# EAGLE board KON-SU260 (EAGLE 6.5.0), part 1 of 2
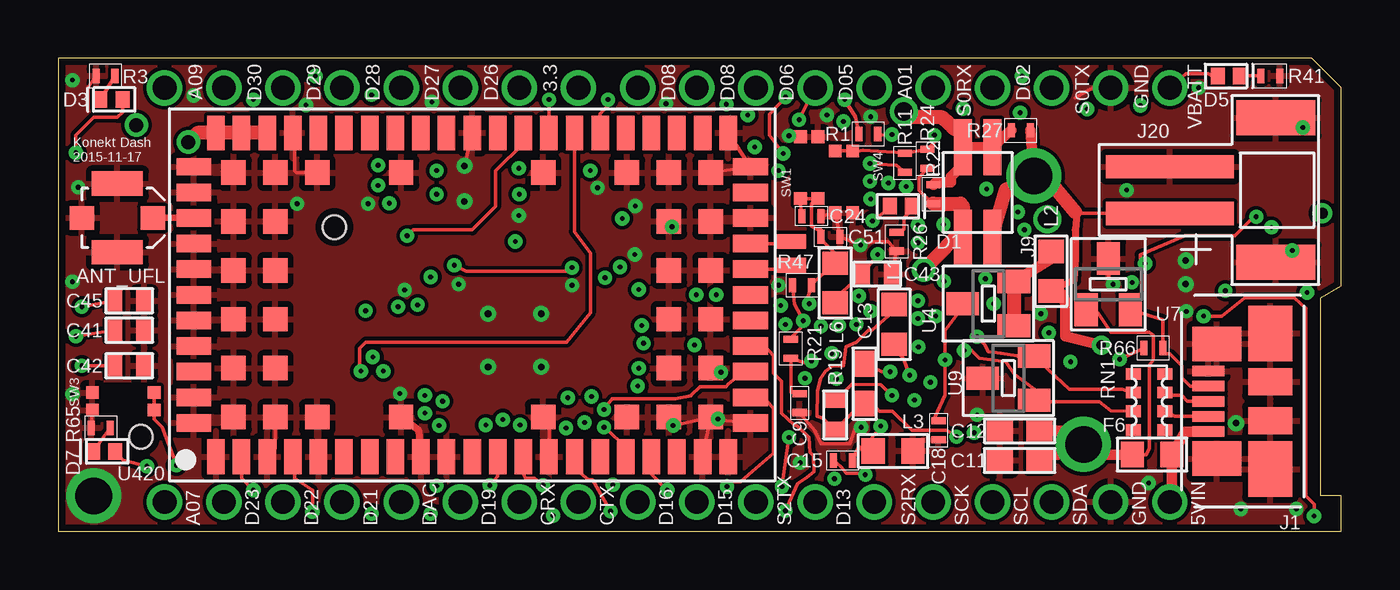
[diagram p5: board, top side]
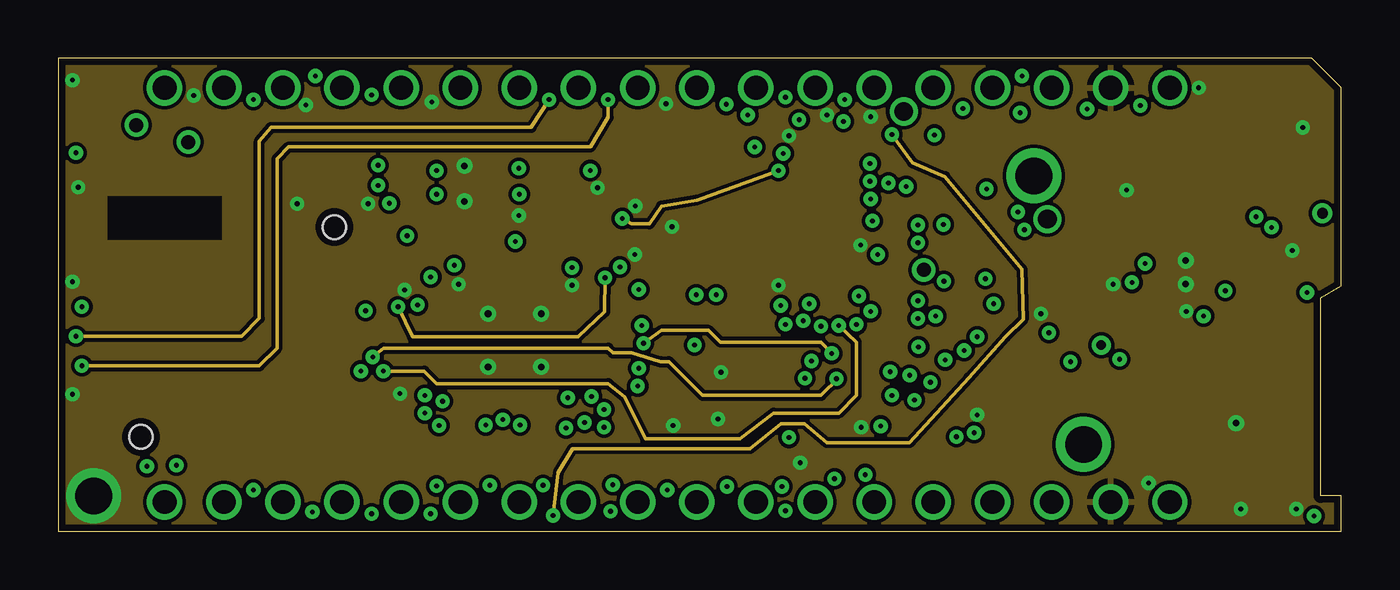
[diagram p6: board, inner layer GND2]
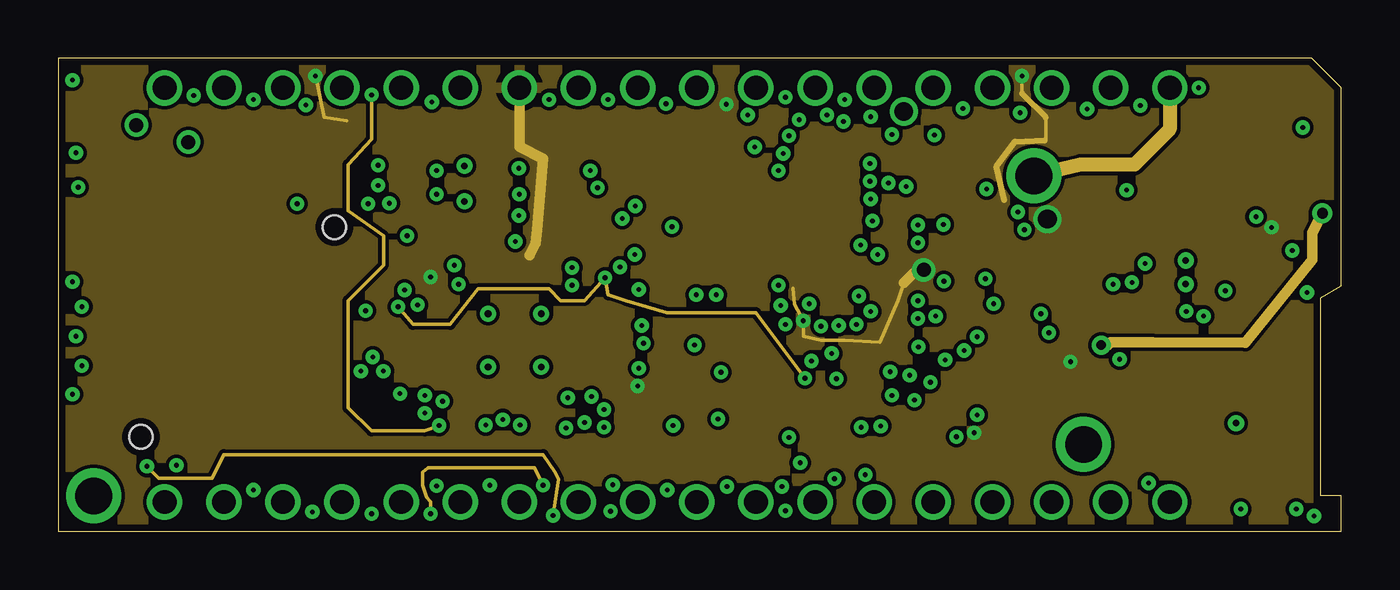
[diagram p7: board, inner layer PWR]
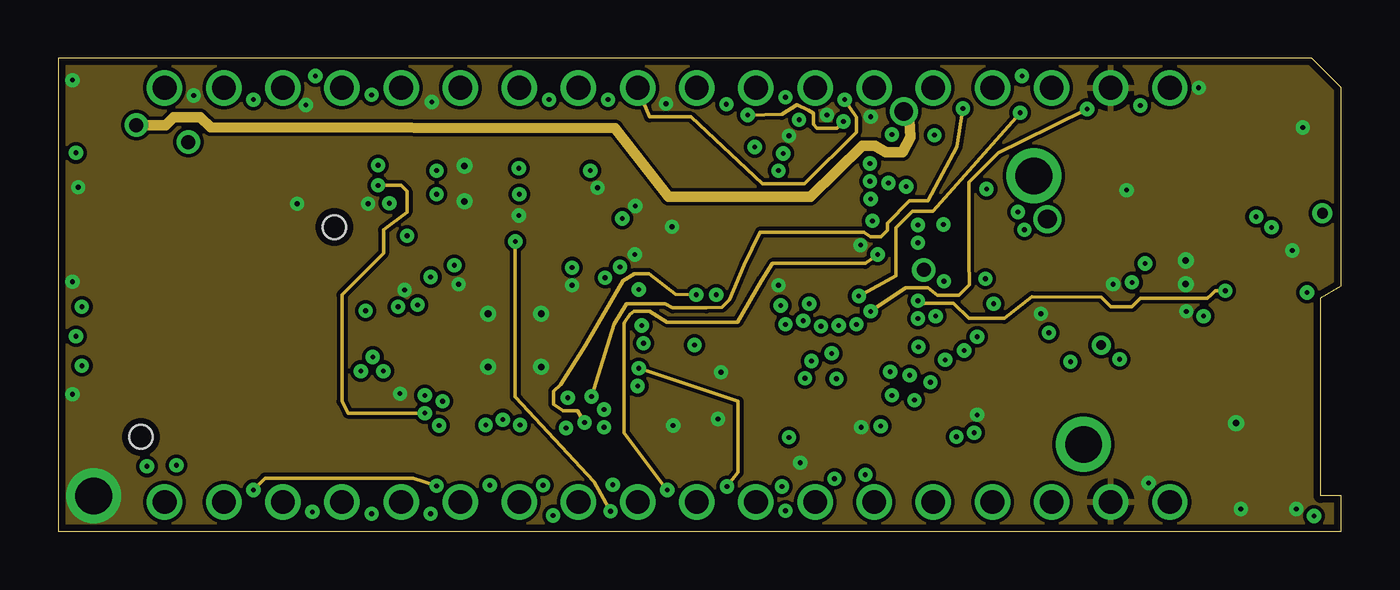
[diagram p8: board, inner layer 14]
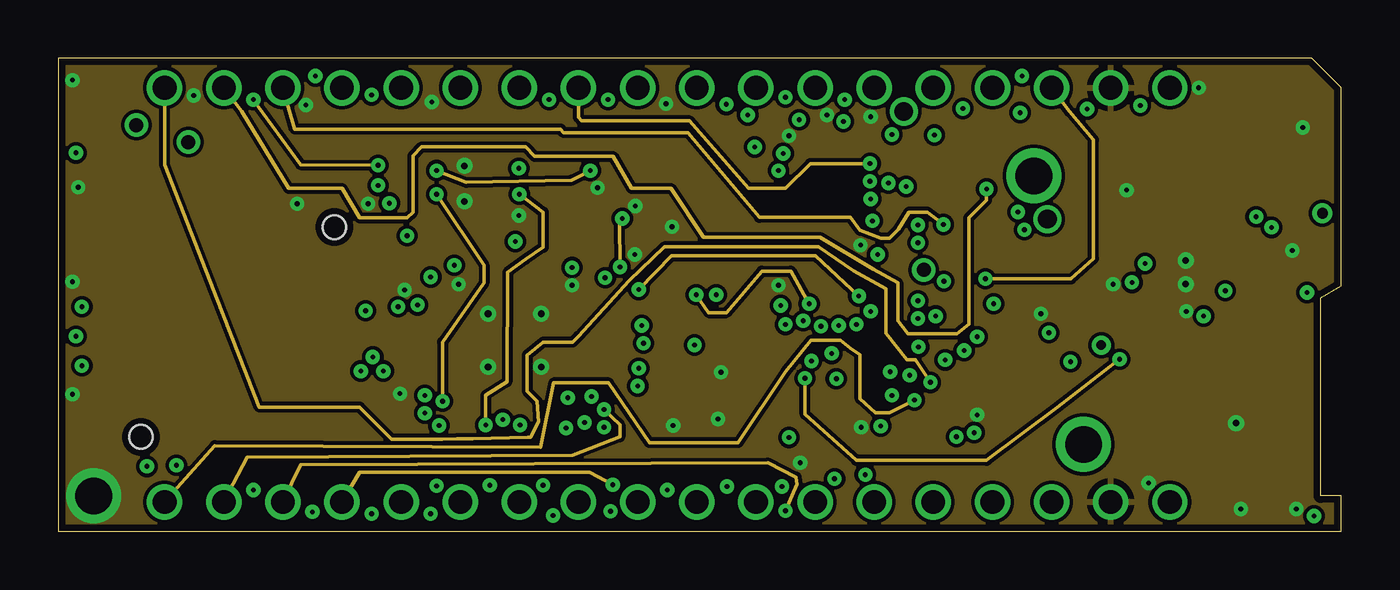
[diagram p9: board, inner layer GND13]
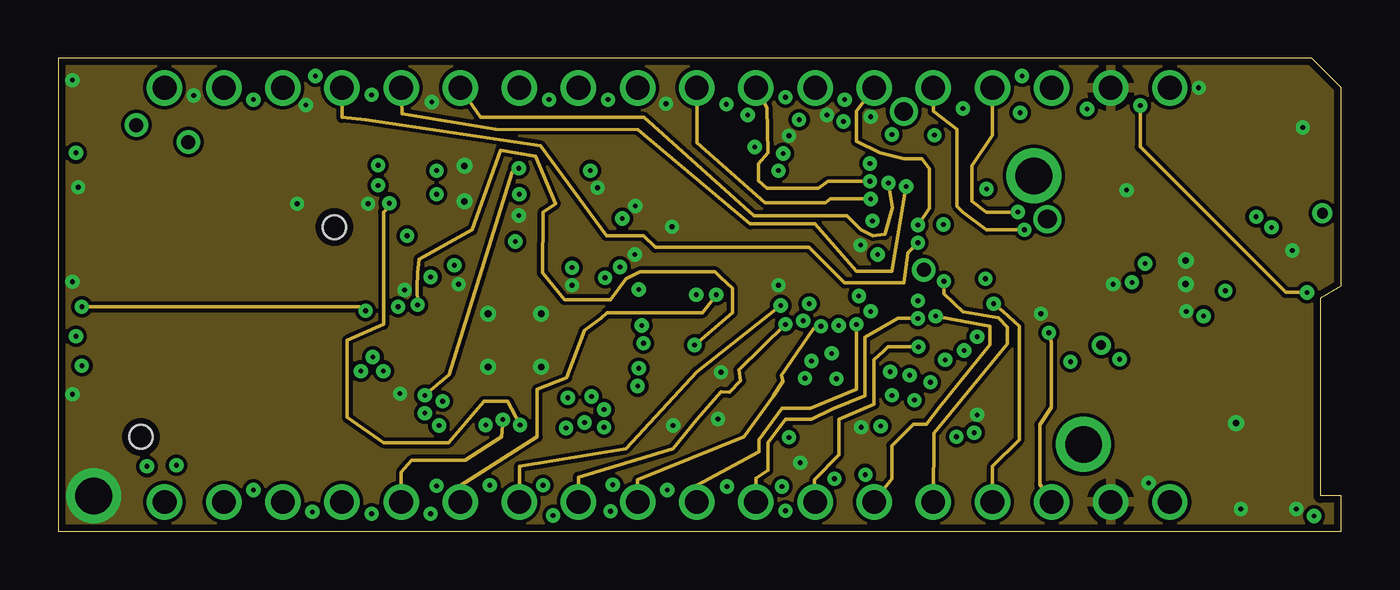
[diagram p10: board, inner layer Route14]
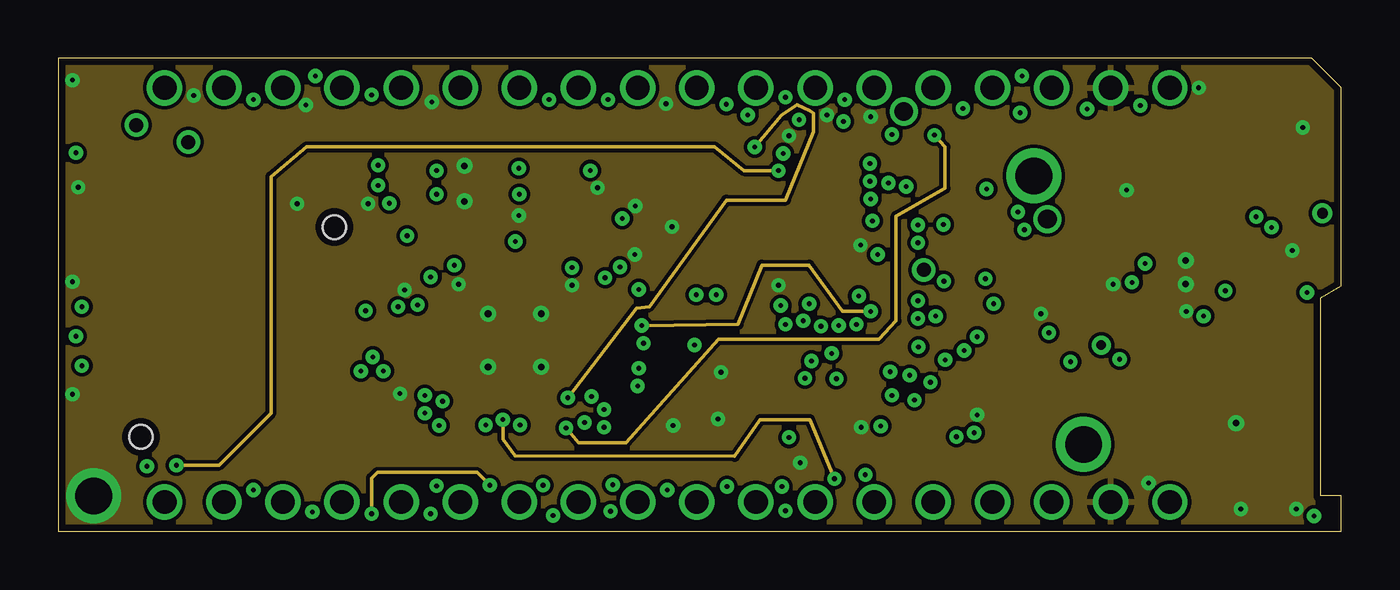
[diagram p11: board, inner layer GND15]
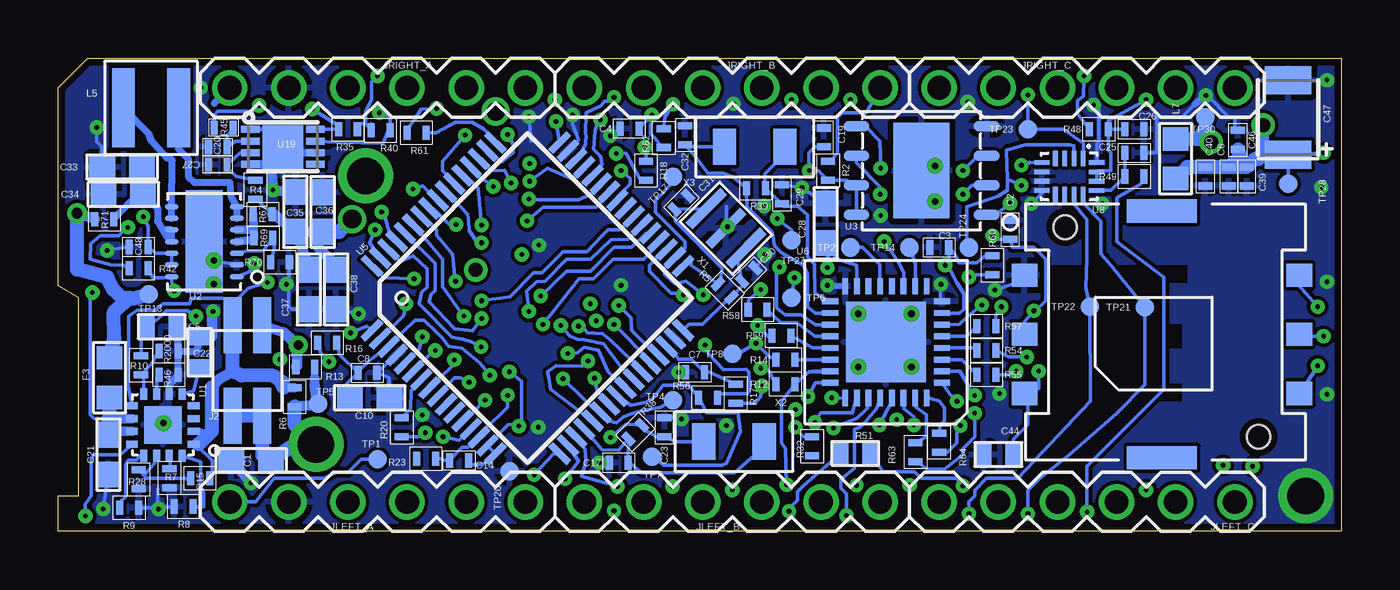
[diagram p12: board, bottom side, seen from below]

Size 55.12 x 20.32 mm. Coordinates in mm from the lower left corner, seen from the top.
Outline: 0,0 55.12,0 55.12,1.52 54.23,1.52 54.23,10.03 55.12,10.54 55.12,19.05 53.85,20.32 0,20.32 0,0
Copper layers (1*2*3*4*13*14*15*16): Top 0.01778125mm / dielectric 6.5mil / GND2 0.01778125mm / dielectric 0.5024125mm / PWR 0.01778125mm / dielectric 6.5mil / 14 0.01778125mm / dielectric 6.5mil / GND13 0.01778125mm / dielectric 6.5mil / Route14 0.01778125mm / dielectric 0.5024125mm / GND15 0.01778125mm / dielectric 6.5mil / Bottom 0.01778125mm
Design rules "default *": minimum track width 6mil, minimum drill 8mil, track to track 6mil, track to pad 6mil, pad to pad 6mil, via to via 6mil, smd to smd 6mil, copper to edge 12mil, drill to drill 8mil, minimum pad ring 10mil, minimum via ring 8mil, stop-mask expansion 4mil, vias tented up to drill 0mil, thermal gap 10mil
Net classes: 1 power: width 0.406 mm, drill 0.61 mm, clearance 0.152 mm; 2 gnd: width 0.203 mm, drill 0.203 mm, clearance 0.152 mm; 3 usbvcc: width 0.203 mm, drill 0.61 mm, clearance 0.152 mm; 4 aref: width 0.203 mm, drill 0.61 mm, clearance 0.152 mm; 5 Vbatt: width 2.5 mm, drill 1 mm, clearance 0.125 mm; 6 HIGH_SPEED: width 0.155 mm, drill 0.203 mm, clearance 0.152 mm; 7 DIFF_HIGH_SPEED: width 0.157 mm, drill 0.203 mm, clearance 0.152 mm
tRestrict: area 10.6,16.5 to 10.9,17.7
bRestrict: area 6.6,10.7 to 13,11.4; area 6.9,7.9 to 13,8.9; area 6.9,5.6 to 12.7,6.3

## Footprints (pad centres in the part's own frame; a part is rotated, then mirrored left to right if it is on the bottom)
UFL = smd 2.2 x 1.05: GND1 0,1.475; GND2 0,-1.475 | smd 1.05 x 1: GND3 -1.525,0; SIGNAL 1.525,0
C0603 = smd 1.1 x 1: 1 -0.85,0; 2 0.85,0
C0402 = smd 0.305 x 0.61: 1 -0.406,0; 2 0.406,0
C0402' = smd 0.7 x 0.9: 1 -0.65,0; 2 0.65,0
0402-CAP@1 = smd 0.305 x 0.61: 1 -0.406,0; 2 0.406,0
0402-CAP = smd 0.305 x 0.61: 1 -0.406,0; 2 0.406,0
CAPC1005X60N = smd 0.305 x 0.61: 1 -0.406,0; 2 0.406,0
1210-CAP = smd 1.2 x 2: 1 -1.6,0; 2 1.6,0
LED_0402_VISHAY_VLMW = smd 0.6 x 0.7: ANODE -0.475,0; CATHODE 0.475,0
R0603 = smd 1 x 1.1: 1 -0.85,0; 2 0.85,0
USB_MICRO_MOLEX_473460001 = smd 1.38 x 0.45: D+ 2.66,0; D- 2.66,0.65; GND 2.66,-1.3; ID 2.66,-0.65; VCC 2.66,1.3 | smd 1.9 x 2.375: GND$1 0,2.913; GND$4 0,-2.913 | smd 1.9 x 1.175: GND$2 0,0.838; GND$3 0,-0.838 | smd 2.1 x 1.475: GND$5 2.3,2.462; GND$6 2.3,-2.462
FCI_CON_1.27_2X2 = smd 0.76 x 2.4: 1 -0.635,-1.95; 2 -0.635,1.95; 3 0.635,-1.95; 4 0.635,1.95
JST-PH-2 = smd 1 x 5.5: BAT 1,-1.75; GND -1,-1.75 | smd 1.5 x 3.4: CHASSIS1 -3.1,2.8; CHASSIS2 3.1,2.8
1X06 = drill 1.016: 1 -6.35,0; 2 -3.81,0; 3 -1.27,0; 4 1.27,0; 5 3.81,0; 6 6.35,0
R0603$1 = smd 1 x 1.1: 1 -0.85,0; 2 0.85,0
COILCRAFT_XFL4020 = smd 0.98 x 3.4: P$1 -1.185,0; P$2 1.185,0
0402-RES = smd 0.305 x 0.61: 1 -0.406,0; 2 0.406,0
R0402 = smd 0.7 x 0.9: 1 -0.65,0; 2 0.65,0
CAY16 = smd 0.5 x 0.65: 1 -1.2,-0.675; 2 -0.4,-0.675; 3 0.4,-0.675; 4 1.2,-0.675; 5 1.2,0.675; 6 0.4,0.675; 7 -0.4,0.675; 8 -1.2,0.675
SIM_CARD_NANO = smd 1 x 1.1: C1 6.94,-1.75; C2 4.4,-1.75; C3 1.86,-1.75; C5 6.94,10.05; C6 4.4,10.05; C7 1.86,10.05 | smd 1 x 3: MTG1 9.7,4.15; MTG2 -0.9,4.15 | hole 1: 0,0; 9,8.3
SWITCH_PANASONIC_EVPBB = smd 0.55 x 0.55: A -1.325,0.375; A2 -1.325,-0.375; B 1.325,0.375; B2 1.325,-0.375
TP08R = smd 0.8 x 0.8: TP 0,0
BAT_CHARGE_ST_MICRO_L6924U = smd 0.3 x 0.5: 1 -0.825,-1.325; 2 -0.275,-1.325; 3 0.275,-1.325; 4 0.825,-1.325; 9 0.825,1.325; 10 0.275,1.325; 11 -0.275,1.325; 12 -0.825,1.325 | smd 0.5 x 0.3: 5 1.325,-0.825; 6 1.325,-0.275; 7 1.325,0.275; 8 1.325,0.825; 13 -1.325,0.825; 14 -1.325,0.275; 15 -1.325,-0.275; 16 -1.325,-0.825 | smd 1.6 x 1.6: PAD 0,0
QFN-14-POWERPAD3X4DSJ = smd 0.24 x 0.6: 1 -1.5,-1.4; 2 -1,-1.4; 3 -0.5,-1.4; 4 0,-1.4; 5 0.5,-1.4; 6 1,-1.4; 7 1.5,-1.4; 8 1.5,1.4; 9 1,1.4; 10 0.5,1.4; 11 0,1.4; 12 -0.5,1.4; 13 -1,1.4; 14 -1.5,1.4 | smd 4.4 x 1.58: POWERPAD 0,0
TDFN8_5X6 = smd 0.45 x 1.1: 1 -1.905,-2.8; 2 -0.635,-2.8; 3 0.635,-2.8; 4 1.905,-2.8; 5 1.905,2.8; 6 0.635,2.8; 7 -0.635,2.8; 8 -1.905,2.8 | smd 4.1 x 2.4: P$9 0,0
SOT23-3 = smd 1 x 1.4: 1 -0.95,-1.1; 2 0.95,-1.1; 3 0,1.1
MK20DX128VLH5 = smd 1.1 x 0.285: 1 -5.605,3.385; 2 -5.605,2.885; 3 -5.605,2.385; 4 -5.605,1.885; 5 -5.605,1.385; 6 -5.605,0.885; 7 -5.605,0.385; 8 -5.605,-0.115; 9 -5.605,-0.615; 10 -5.605,-1.115; 11 -5.605,-1.615; 12 -5.605,-2.115; 13 -5.605,-2.615; 14 -5.605,-3.115; 15 -5.605,-3.615; 16 -5.605,-4.115; 33 5.795,-4.115; 34 5.795,-3.615; 35 5.795,-3.115; 36 5.795,-2.615; 37 5.795,-2.115; 38 5.795,-1.615; 39 5.795,-1.115; 40 5.795,-0.615; 41 5.795,-0.115; 42 5.795,0.385; 43 5.795,0.885; 44 5.795,1.385; 45 5.795,1.885; 46 5.795,2.385; 47 5.795,2.885; 48 5.795,3.385 | smd 0.285 x 1.1: 17 -3.655,-6.065; 18 -3.155,-6.065; 19 -2.655,-6.065; 20 -2.155,-6.065; 21 -1.655,-6.065; 22 -1.155,-6.065; 23 -0.655,-6.065; 24 -0.155,-6.065; 25 0.345,-6.065; 26 0.845,-6.065; 27 1.345,-6.065; 28 1.845,-6.065; 29 2.345,-6.065; 30 2.845,-6.065; 31 3.345,-6.065; 32 3.845,-6.065; 49 3.845,5.335; 50 3.345,5.335; 51 2.845,5.335; 52 2.345,5.335; 53 1.845,5.335; 54 1.345,5.335; 55 0.845,5.335; 56 0.345,5.335; 57 -0.155,5.335; 58 -0.655,5.335; 59 -1.155,5.335; 60 -1.655,5.335; 61 -2.155,5.335; 62 -2.655,5.335; 63 -3.155,5.335; 64 -3.655,5.335
QFN_32_5X5 = smd 0.7 x 0.25: 1 -2.4,1.75; 2 -2.4,1.25; 3 -2.4,0.75; 4 -2.4,0.25; 5 -2.4,-0.25; 6 -2.4,-0.75; 7 -2.4,-1.25; 8 -2.4,-1.75; 17 2.4,-1.75; 18 2.4,-1.25; 19 2.4,-0.75; 20 2.4,-0.25; 21 2.4,0.25; 22 2.4,0.75; 23 2.4,1.25; 24 2.4,1.75 | smd 0.25 x 0.7: 9 -1.75,-2.4; 10 -1.25,-2.4; 11 -0.75,-2.4; 12 -0.25,-2.4; 13 0.25,-2.4; 14 0.75,-2.4; 15 1.25,-2.4; 16 1.75,-2.4; 25 1.75,2.4; 26 1.25,2.4; 27 0.75,2.4; 28 0.25,2.4; 29 -0.25,2.4; 30 -0.75,2.4; 31 -1.25,2.4; 32 -1.75,2.4 | smd 3.45 x 3.45: PAD 0,0
SOT23 = smd 1 x 1.4: 1 -0.95,-1.1; 2 0.95,-1.1; 3 0,1.1
UQFN_16 = smd 0.2 x 0.65: P$1 -0.6,-0.775; P$2 -0.2,-0.775; P$3 0.2,-0.775; P$4 0.6,-0.775; P$9 0.6,0.775; P$10 0.2,0.775; P$11 -0.2,0.775; P$12 -0.6,0.775 | smd 0.65 x 0.2: P$5 1.175,-0.6; P$6 1.175,-0.2; P$7 1.175,0.2; P$8 1.175,0.6; P$13 -1.175,0.6; P$14 -1.175,0.2; P$15 -1.175,-0.2; P$16 -1.175,-0.6
TDFN-8 = smd 0.8 x 0.3: 1 -1.4,0.75; 2 -1.4,0.25; 3 -1.4,-0.25; 4 -1.4,-0.75; 5 1.4,-0.75; 6 1.4,-0.25; 7 1.4,0.25; 8 1.4,0.75 | smd 1.73 x 1.88: EP 0,0
91-PIN_LGA = smd 1.5 x 0.75: 1 -6.95,11; 2 -6.95,9.9; 3 -6.95,8.8; 4 -6.95,7.7; 5 -6.95,6.6; 6 -6.95,5.5; 7 -6.95,4.4; 8 -6.95,3.3; 9 -6.95,2.2; 10 -6.95,1.1; 11 -6.95,0; 12 -6.95,-1.1; 13 -6.95,-2.2; 14 -6.95,-3.3; 15 -6.95,-4.4; 16 -6.95,-5.5; 17 -6.95,-6.6; 18 -6.95,-7.7; 19 -6.95,-8.8; 20 -6.95,-9.9; 21 -6.95,-11; 33 6.95,-11; 34 6.95,-9.9; 35 6.95,-8.8; 36 6.95,-7.7; 37 6.95,-6.6; 38 6.95,-5.5; 39 6.95,-4.4; 40 6.95,-3.3; 41 6.95,-2.2; 42 6.95,-1.1; 43 6.95,0; 44 6.95,1.1; 45 6.95,2.2; 46 6.95,3.3; 47 6.95,4.4; 48 6.95,5.5; 49 6.95,6.6; 50 6.95,7.7; 51 6.95,8.8; 52 6.95,9.9; 53 6.95,11 | smd 0.75 x 1.5: 22 -5.5,-11.95; 23 -4.4,-11.95; 24 -3.3,-11.95; 25 -2.2,-11.95; 26 -1.1,-11.95; 27 0,-11.95; 28 1.1,-11.95; 29 2.2,-11.95; 30 3.3,-11.95; 31 4.4,-11.95; 32 5.5,-11.95; 54 5.5,11.95; 55 4.4,11.95; 56 3.3,11.95; 57 2.2,11.95; 58 1.1,11.95; 59 0,11.95; 60 -1.1,11.95; 61 -2.2,11.95; 62 -3.3,11.95; 63 -4.4,11.95; 64 -5.5,11.95 | smd 1.05 x 1.05: 65 -5.25,10.25; 66 -3.15,10.25; 67 -1.05,10.25; 68 1.05,10.25; 69 3.15,10.25; 70 5.25,10.25; 71 -5.25,8.45; 72 -3.15,8.45; 73 -1.05,8.45; 74 1.05,8.45; 75 3.15,8.45; 76 5.25,8.45; 77 -5.25,6.65; 78 5.25,6.65; 79 -5.25,3.05; 80 5.25,3.05; 81 -5.25,-3.05; 82 5.25,-3.05; 83 -5.25,-6.65; 84 5.25,-6.65; 85 -5.25,-8.45; 86 -3.15,-8.45; 87 -1.05,-8.45; 88 1.05,-8.45; 89 3.15,-8.45; 90 5.25,-8.45; 91 -5.25,-10.25; 92 -3.15,-10.25; 93 -1.05,-10.25; 94 1.05,-10.25; 95 3.15,-10.25; 96 5.25,-10.25
TESTPAD = smd 1.27 x 0.635: P$1 0,0
CRYSTAL_RESONATOR_MURATA_CSTCE = smd 0.4 x 2.1: GND 0,0; XTAL1 -1.2,0; XTAL2 1.2,0
CRYSTAL_ST3215SB = smd 1 x 1.55: P$1 -1.3,0; P$2 1.3,0

## Placement (x,y rotation side)
ANT_UFL  ANT-A-1JB  [UFL]  2.54,13.46 0 top
C1  1 uF  [C0603]  46.84,3.05 180 bottom
C2  0.1 uF  [C0402]  14.22,12.95 90 bottom
C3  0.1 uF  [C0402]  17.27,12.19 180 bottom
C4  0.1 uF  [C0402]  30.58,17.3 180 bottom
C5  1 nF  [C0402']  50.67,8.79 0 bottom
C6  100nF  [0402-CAP@1]  4.83,15.24 90 bottom
C7  0.1 uF  [C0402]  27.76,6.83 180 bottom
C8  0.1 uF  [C0402]  41.83,6.81 0 bottom
C9  0.1 uF  [C0402]  31.85,5.51 270 top
C10  2.2 uF  [C0603]  41.73,5.74 0 bottom
C11  2.2 uF  [C0603]  41.3,3.05 180 top
C12  0.1 uF  [C0603]  41.3,4.32 180 top
C13  2.2 uF  [C0603]  34.65,6.35 90 top
C14  0.1 uF  [C0402]  37.9,3.05 0 bottom
C15  0.1 uF  [C0402]  33.71,3.05 0 top
C17  15 pf  [C0402]  31.04,2.95 180 bottom
C18  0.1 uF  [C0402]  37.82,4.34 270 top
C19  0.1 uF  [C0402]  22.23,16.92 90 bottom
C20  1uF  [0402-CAP]  48.26,16.51 180 bottom
C21  1 uF  [C0603]  52.96,3.3 270 bottom
C22  10 nF  [C0402']  49.05,7.7 90 bottom
C23  15 pf  [C0402]  29.08,4.47 90 bottom
C24  0.1 uF  [C0402]  32.36,13.54 0 top
C25  0.1 uF  [C0402]  8.89,16.26 0 bottom
C26  0.1 uF  [C0402]  8.89,17.27 0 bottom
C27  10nF  [CAPC1005X60N]  48.26,15.75 0 bottom
C28  2.2 uF  [C0603]  22.15,13.23 90 bottom
C29  15 pf  [C0402]  24.03,14.48 90 bottom
C30  22 pf  [C0402]  25.45,11.02 45 bottom
C31  22 pf  [C0402]  28.35,14.12 45 bottom
C32  15 pf  [C0402]  28.19,17.02 90 bottom
C33  10 uF  [C0603]  52.37,15.65 180 bottom
C34  10 uF  [C0603]  52.32,14.48 180 bottom
C35  22 uF  [C0603]  44.93,13.72 90 bottom
C36  22 uF  [C0603]  43.76,13.72 90 bottom
C37  22 uF  [C0603]  44.35,10.39 270 bottom
C38  22 uF  [C0603]  43.18,10.39 270 bottom
C39  10nF  [0402-CAP@1]  4.06,15.24 90 bottom
C40  56pF  [0402-CAP@1]  5.84,15.24 90 bottom
C41  47 pF  [C0402']  3.05,8.64 0 top
C42  47 pF  [C0402']  3.05,7.11 0 top
C43  47 pF  [C0402']  35.18,11.05 0 top
C44  47 pF  [C0402']  14.73,3.3 180 bottom
C45  47 pF  [C0402']  3.05,9.91 0 top
C46  15pF  [0402-CAP@1]  4.45,16.81 270 bottom
C47  330uF  [1210-CAP]  2.29,17.78 90 bottom
C48  0.1 uF  [C0402]  51.66,12.22 180 bottom
C51  0.22 uF  [C0402]  33.17,12.65 0 top
D1  LED_0402_VLMW  [LED_0402_VISHAY_VLMW]  36.2,13.97 0 top
D3  LED_0402_VLMW  [LED_0402_VISHAY_VLMW]  2.29,18.54 180 top
D5  LED_0402_VLMW  [LED_0402_VISHAY_VLMW]  50.29,19.56 0 top
D7  LED_0402_VLMW  [LED_0402_VISHAY_VLMW]  1.98,3.43 180 top
F3  3A  [R0603]  52.91,6.6 270 bottom
F6  3A  [R0603]  46.99,3.3 180 top
J1  USB_MICRO_B_MOLEX_473460001  [USB_MICRO_MOLEX_473460001]  52.07,5.59 180 top
J2  CON_JUMPER_1.27_2X2  [FCI_CON_1.27_2X2]  46.99,6.91 180 bottom
J7  JUMPER_1.27MM  [NOTHING]  0.51,0 0 top
J8  JUMPER_1.27MM  [NOTHING]  0.76,0 0 top
J9  CON_JUMPER_1.27_2X2  [FCI_CON_1.27_2X2]  39.5,14.55 0 top
J20  BAT_TERM  [JST-PH-2]  49.5,14.66 270 top
JLEFT_A  [1X06]  41.4,1.27 180 bottom
JLEFT_B  [1X06]  26.16,1.27 180 bottom
JLEFT_C  [1X06]  10.92,1.27 180 bottom
JRIGHT_A  [1X06]  41.4,19.05 180 bottom
JRIGHT_B  [1X06]  26.16,19.05 180 bottom
JRIGHT_C  [1X06]  10.92,19.05 180 bottom
L1  INDUCTOR_0603  [R0603$1]  35.92,8.89 90 top
L2  INDUCTOR_0603  [R0603$1]  42.65,11.18 90 top
L3  INDUCTOR_0603  [R0603$1]  35.86,3.45 0 top
L5  1uH  [COILCRAFT_XFL4020]  51.13,18.19 0 bottom
L6  INDUCTOR_0603  [R0603$1]  33.38,10.67 90 top
L7  INDUCTOR_0603  [R0603$1]  7.11,16 90 bottom
R1  0  [0402-RES]  34.8,17.07 180 top
R2  0  [0402-RES]  22.05,15.49 90 bottom
R3  75  [0402-RES]  2.03,19.56 180 top
R4  0  [0402-RES]  46.64,14.67 90 bottom
R5  1M  [0402-RES]  26.49,10.34 315 bottom
R6  0  [0402-RES]  44.96,5.77 90 bottom
R7  24K  [0402-RES]  50.34,2.29 90 bottom
R8  24K  [0402-RES]  49.73,1.07 0 bottom
R9  3.3K  [0402-RES]  52.07,1.02 180 bottom
R10  1K  [0402-RES]  51.56,7.14 90 bottom
R11  0  [0402-RES]  36.37,15.82 90 top
R12  0  [0402-RES]  23.88,6.32 180 bottom
R13  0  [0402-RES]  44.5,7.06 180 bottom
R14  0  [0402-RES]  23.88,7.37 180 bottom
R15  0  [0402-RES]  49.02,2.29 0 bottom
R16  0  [0402-RES]  43.56,8.1 0 bottom
R17  0  [0402-RES]  26.01,5.92 90 bottom
R18  0  [0402-RES]  29.11,16.89 270 bottom
R19  470  [R0402]  33.38,5 90 top
R20  0  [0402-RES]  40.36,4.47 90 bottom
R21  0  [0402-RES]  31.47,7.85 270 top
R22  0  [0402-RES]  37.59,14.48 90 top
R23  0  [0402-RES]  39.32,3.12 0 bottom
R24  10K  [0402-RES]  37.34,16 270 top
R26  75  [0402-RES]  36.02,12.45 270 top
R27  0  [0402-RES]  41.35,17.22 180 top
R28  0  [0402-RES]  51.66,2.24 90 bottom
R32  0  [0402-RES]  22.73,3.66 270 bottom
R35  10K  [0402-RES]  42.67,17.27 0 bottom
R38  1M  [0402-RES]  30.33,4.27 45 bottom
R39  1M  [0402-RES]  25.15,14.73 0 bottom
R40  10K  [0402-RES]  41.27,17.22 180 bottom
R41  75  [0402-RES]  52.07,19.56 0 top
R42  1M  [0402-RES]  51.66,11.3 180 bottom
R45  1k  [0402-RES]  48.01,17.34 180 bottom
R46  0  [0402-RES]  50.37,6.73 180 bottom
R47  10K  [0402-RES]  31.95,10.57 180 top
R48  0  [0402-RES]  10.41,17.27 0 bottom
R49  0  [0402-RES]  8.89,15.24 180 bottom
R51  100K  [R0402]  20.88,3.35 180 bottom
R54  0  [0402-RES]  15.24,7.77 0 bottom
R55  0  [0402-RES]  15.24,6.73 0 bottom
R56  0  [0402-RES]  27.2,5.74 180 bottom
R57  0  [0402-RES]  15.24,8.81 0 bottom
R58  0  [0402-RES]  25.07,9.53 180 bottom
R59  0  [0402-RES]  24.05,8.41 180 bottom
R60  0  [0402-RES]  14.99,11.43 90 bottom
R61  0  [0402-RES]  39.73,17.12 180 bottom
R62  0  [0402-RES]  29.87,15.49 90 bottom
R63  0  [0402-RES]  18.29,3.4 90 bottom
R64  0  [0402-RES]  17.27,3.81 90 bottom
R65  75  [0402-RES]  1.83,4.45 180 top
R66  0  [0402-RES]  47.04,7.87 180 top
R67  0  [0402-RES]  46.33,13.61 0 bottom
R69  0  [0402-RES]  46.3,12.6 180 bottom
R70  0  [0402-RES]  45.59,11.56 180 bottom
R71  0  [0402-RES]  53.14,13.41 0 bottom
R2000  470  [0402-RES]  50.37,7.75 180 bottom
RN1  22R  [CAY16]  46.86,5.56 90 top
SIM1  SIM_CARD_NANO  [SIM_CARD_NANO]  3.56,4.06 90 bottom
SW1  SWITCH_PANASONIC_EVP-BB2A1B000  [SWITCH_PANASONIC_EVPBB]  32.26,15.62 90 top
SW3  SWITCH_PANASONIC_EVP-BB2A1B000  [SWITCH_PANASONIC_EVPBB]  2.79,5.59 180 top
SW4  SWITCH_PANASONIC_EVP-BB2A1B000  [SWITCH_PANASONIC_EVPBB]  33.76,15.01 270 top
TP1  TPTP08R  [TP08R]  41.4,3.1 0 bottom
TP2  TPTP08R  [TP08R]  21.08,12.19 180 bottom
TP4  TPTP08R  [TP08R]  28.7,5.64 0 bottom
TP5  TPTP08R  [TP08R]  43.94,5.49 0 bottom
TP6  TPTP08R  [TP08R]  23.62,10.03 0 bottom
TP7  TPTP08R  [TP08R]  29.62,3.2 0 bottom
TP8  TPTP08R  [TP08R]  26.16,7.62 0 bottom
TP13  TPTP08R  [TP08R]  51.23,10.19 270 bottom
TP14  TPTP08R  [TP08R]  18.54,12.19 180 bottom
TP17  TPTP08R  [TP08R]  28.7,15.24 270 bottom
TP20  TPTP08R  [TP08R]  35.74,2.59 270 bottom
TP21  TPTP08R  [TP08R]  8.43,9.63 180 bottom
TP22  TPTP08R  [TP08R]  10.79,9.65 180 bottom
TP23  TPTP08R  [TP08R]  13.46,17.27 180 bottom
TP24  TPTP08R  [TP08R]  16,12.19 180 bottom
TP27  TPTP08R  [TP08R]  23.62,12.5 180 bottom
TP28  TPTP08R  [TP08R]  2.29,14.94 0 bottom
TP30  TPTP08R  [TP08R]  5.84,17.78 0 bottom
U1  ST_MICRO_BAT_CHARGER_L6924U013  [BAT_CHARGE_ST_MICRO_L6924U]  50.62,4.57 90 bottom
U2  TPS63021  [QFN-14-POWERPAD3X4DSJ]  48.84,12.45 90 bottom
U3  MICROCHIP_FLASH_MEM  [TDFN8_5X6]  18.03,15.49 90 bottom
U4  DIODE_DUAL_SCHOTKEY  [SOT23-3]  39.95,9.78 90 top
U5  MK20DX128VLH5  [MK20DX128VLH5]  35.28,10.21 45 bottom
U6  FREESCALE_MKL17Z256VFM4  [QFN_32_5X5]  19.56,8.13 180 bottom
U7  PESD12VL2BT,215  [SOT23]  45.11,10.62 0 top
U8  VOLTAGE_TRANSLATOR_4_BIT  [UQFN_16]  11.68,15.24 180 bottom
U9  PESD12VL2BT,215  [SOT23]  40.82,6.58 90 top
U19  MAX1704X  [TDFN-8]  45.47,16.51 0 bottom
U420  SARA-U2XX  [91-PIN_LGA]  17.78,10.16 90 top
U$1  TESTPAD  [TESTPAD]  31.5,12.45 0 top
U$2  TESTPAD  [TESTPAD]  31.5,11.43 180 top
X1  16 MHz  [CRYSTAL_RESONATOR_MURATA_CSTCE]  26.43,13.02 135 bottom
X2  32.768 kHz  [CRYSTAL_ST3215SB]  26.09,3.86 180 bottom
X3  32.768 kHz  [CRYSTAL_ST3215SB]  25.2,16.51 0 bottom

## Tracks (layer width: path | path; a pad name or v marks a point on that pad's centre or on a via)
+3.3V  (via drill 0.2, 0.6, 0.8)
  Top 0.157: R22.1 37.16,14.45 36.98,14.66 36.98,15.19 R24.2 | R47.2 31.62,9.75 v32,9.04 32,8.87 31.85,8.69 31.47,8.31 R21.1
  Top 0.61: v37.19,11.23 38.44,12.53 J9.1 38.86,13.97 38.76,14.07 R22.1
  PWR 0.157: v11.05,19.56 11.43,17.78 12.39,17.63 | v41.4,19.56 41.4,18.8 | 42.42,17.78 42.42,16.84 42.37,16.79 | 31.57,10.44 31.62,9.75 v32,9.04 32,8.38 32.77,8.2 33.78,8.2 35.31,8.13 36.07,9.91 36.32,10.67
  PWR 0.254: 40.64,14.22 40.31,15.67 41.1,16.74 42.37,16.79 | 41.4,18.8 42.42,17.78
  PWR 0.457: JRIGHT_B.1 19.81,16.51 20.83,16 20.57,12.95 20.5,12.37 20.24,11.86 | v37.19,11.23 37.08,11.43 36.32,10.67
  Bottom 0.157: R20.1 39.65,4.06 v39.34,4.24 | v16,10.92 15.9,11.02 R60.1 15.24,10.92 | R17.1 25.2,5.51 24.94,5.79 v24.89,6.25 | R48.1 11.33,17.93 11.33,18.49 11.09,18.68 11.06,19.42 v11.05,19.56 | R42.2 52.32,11.43 52.86,11.46 53.75,11.68 53.72,12.34 53.31,12.7 52.53,12.7 52.32,12.9 v52.12,13.06 | R4.1 46.5,14.19 R67.2 | 41.68,17.5 R40.2 41.91,17.5 | v41.4,19.56 41.66,19.3 41.66,18.54 41.91,18.03 41.91,17.5 | 41.91,17.5 42.27,17.5 R35.2 | R18.1 29.06,17.8 v28.7,18.34 | R2.2 21.95,15.9 21.64,16.26 21.64,17.78 21.41,17.98 20.4,17.98 JRIGHT_B.1 | R16.1 43.84,7.67 v43.48,7.29
  Bottom 0.457: C35.1 C36.1 | C36.1 43.89,13.01 | R67.2 45.83,13.61 C35.1 | C35.1 44.52,11.87 C37.1 | C38.1 43.18,11.43 43.94,12.19 43.94,12.68 C36.1
  Bottom 0.61: C36.1 43.04,12.87 v42.49,13.41
  pour PWR: 0,20.32 0,0 55.12,0 55.12,20.32
+3.3V_FLASH  (via drill 0.2)
  GND13 0.157: v16.26,15.49 17.53,14.99 R2.1 v22.86,15.49
  Bottom 0.157: C19.1 22.61,16.51 22.86,16.26 v22.86,15.49 22.45,15.49 R2.1 21.26,15.09 U3.7 U3.8 | U3.3 15.62,16.13 v16.26,15.49
+3.3V_GOOD  (via drill 0.2)
  14 0.157: v50.14,10.34 49.71,10.34 49.53,10.16 49.35,10.01 46.48,10.01 46.13,9.65 45.21,9.65 44.81,10.06 41.83,10.08 40.64,9.14 39.12,9.14 38.46,9.8 37.21,9.8 37.13,9.91 v36.93,9.91
  Bottom 0.157: U5.39 30.42,13.52 30.99,12.95 31.5,12.95 31.75,12.7 32.41,12.01 33.43,12.01 34.34,11.1 34.7,11.1 35.71,10.08 v36.93,9.91 | R42.1 51.05,10.89 50.57,10.9 U2.14 50.22,10.42 v50.14,10.34
AGND  (via drill 0.2)
  Top 0.157: v35.74,6.86 35.39,6.86 C13.2 | v35.33,4.52 34.73,3.75 L3.1 34.52,3.48 34.47,3.61 34.37,3.61 C15.2
  Bottom 0.157: 35.2,4.6 35.79,4.57 36.66,3.7 U5.15 U5.16 36.39,3.34 36.88,2.87 37.36,2.87 37.49,3 C14.2 | 35.2,4.6 35.2,6.45 v35.74,6.86 | v35.33,4.52 35.2,4.6
AREF  (via drill 0.2)
  Top 0.157: R19.2 33.83,6.07 34.09,6.33 35.33,6.3 v35.81,5.84
  Bottom 0.157: v35.81,5.84 35.81,5.33 36.2,4.95 36.6,4.57 37.04,4.11 U5.14 37.1,4.04 37.52,3.61 37.77,3.61 C14.1 38.56,3.05 38.63,3.12 R23.2
BL_SCL  (via drill 0.2)
  14 0.157: v41.33,17.98 37.57,13.74 36.7,13.74 35.99,13.03 35.99,10.97 v34.39,10.11
  GND13 0.157: v24.94,10.39 26.34,11.84 32.54,11.84 v34.39,10.11
  Bottom 0.157: U5.37 29.86,12.81 30.48,12.19 31.24,12.19 32.26,11.18 33.27,11.18 v34.39,10.11 | 25.55,9.5 R58.2 25.48,9.93 v24.94,10.39 | U19.7 43.08,16.71 41.17,16.66 40.94,17.2 R40.1 40.87,17.75 v41.33,17.98
BL_SDA  (via drill 0.2)
  14 0.157: v34.9,9.45 36.42,10.46 37.36,10.46 37.77,10.13 38.68,10.13 39.14,10.59 39.12,11.68 39.12,14.99 40.39,16.26 41.4,16.76 v44.2,18.14
  GND15 0.157: v25.07,8.84 29.21,8.89 30.23,11.43 32.26,11.43 33.68,9.45 v34.9,9.45
  Bottom 0.157: U5.38 30.65,12.56 31.37,12.52 32.26,11.68 33.27,11.68 34.21,10.74 34.57,10.72 35,10.31 v34.9,9.45 | R59.2 24.64,8.38 v25.07,8.84 | U19.8 43.57,17.26 R35.1 43.08,17.42 v44.2,18.14
EZP_CS  (via drill 0.2)
  GND2 0.157: v13.97,6.88 15.72,6.88 16.26,6.35 23.62,6.35 24.33,5.79 25.22,3.99 29.29,3.99 30.73,5.08 33.53,5.08 34.29,5.84 34.29,8.13 v33.53,8.84
  Bottom 0.155: U5.26 30.99,7.11 31.7,8.05 32.54,8.23 32.82,8.26 33.12,8.38 v33.53,8.84
  Bottom 0.157: R55.2 14.35,6.73 v13.97,6.88
GND  (via drill 0.2, 0.21, 0.28, 1.57)
  Top 0.157: 1.37,6.06 SW3.B2 | SW3.B 1.42,4.5 R65.2 | U420.78 10.24,15.41 10.16,15.49 10.16,17.03 U420.50 | U420.71 9.33,3.56 U420.3 | U420.14 21.08,4.66 U420.81 | U420.43 v17.45,15.7 | U420.96 U420.32 U420.33 | SW1.B v31.39,16.99 | C24.2 SW4.B2 C51.2 v34.47,12.29 35,12.45 35.66,12.45 R26.2 C43.2 | U420.85 v26.42,4.55 U420.91 U420.20 | 29.08,4.45 U420.22 27.94,4.83 27.91,4.8 | U420.92 28.45,6.86 27.94,6.86 | C9.2 32.51,4.32 32.77,3.76 34.01,3.76 34.24,4.45 34.27,4.47 v34.49,4.47 | R3.2 1.27,19.05 1.27,18.03 | 43.69,18.62 44.45,19.05 JRIGHT_A.5 | U7.3 45.11,10.82 v45.31,10.62
  Top 0.305: U420.9 15.49,4.32 U420.79
  Bottom 0.157: v5.82,18.72 5.77,18.72 4.83,17.78 4.57,17.78 4.57,17.35 C46.1 | C25.2 7.93,16.26 7.93,17.78 6.86,17.78 6.27,18.36 | U8.P$16 10.51,16.64 10.41,16.74 10.41,18.13 v10.64,18.31 | SIM1.C5 13.61,10.85 13.97,10.85 13.97,10.67 v14.88,10.36 | U6.8 17.21,10 v17.2,10.62 | C29.2 v23.16,14.76 C28.2 | v24.77,11.89 C30.2 | 26.42,13.97 26.42,13.21 v26.37,13.08 X1.GND | C4.2 v31.39,16.99 | v34.9,17.8 34.8,16.76 | C7.2 28.45,6.86 | C17.2 v31.88,2.95 | C33.2 53.24,16.51 53.46,16.73 v53.46,17.35 | v53.02,12.06 C48.2 | U2.POWERPAD v48.44,11.63 U2.2 | C38.2 v42.22,9.35 | v48.46,9.45 48.51,9.4 | U5.4 C8.2 40.89,6.6 C10.2 | U5.47 32.77,16.82 33.02,17.48 v33.02,17.88 | C23.2 28.35,4.88 v28.35,4.83 | R9.1 50.85,1.02 | 50.85,1.02 v50.8,0.96 50.7,1.07 R8.1 | 50.85,1.83 50.85,1.02 | U8.P$8 12.86,14.52 v13.31,14.07 | C37.2 45.1,9.54 45.21,9.65 45.21,10.52 v45.31,10.62 45.19,10.74 R70.1 | U19.1 45.72,17.26 45.72,17.27 45.47,17.27 U19.EP | C21.2 v53.19,0.96
  Bottom 0.254: U6.16 22.07,10.53 v22.07,10.57
  Bottom 0.305: U1.6 50.35,6.27 R46.1 R2000.1 | R2000.1 49.96,8.75 C5.2 | R2000.1 49.14,7.75 C22.2 | 6.27,18.36 v5.82,18.72 | U19.EP 44.7,16.26 U19.6
  Bottom 0.356: U19.4 46,15.76
  Bottom 0.406: U6.PAD 18.47,8.13 v18.47,7.06
  Bottom 0.457: 48.51,9.4 48.51,8.38 | v46.84,2.08 C1.2 | C35.2 v45.89,14.66 46,15.76
  other vias: 30.94,10.57 20.75,9.35 18.47,9.35 20.75,7.06 17.45,14.17 16.05,18.44 14.68,5.92 1.52,1.52 50.6,4.65 0.61,5.89 0.86,14.78 0.61,19.38 10.26,14.07 0.61,10.72 19.79,13.56 39.47,5 24.79,13.97 26.11,18.36 28.47,6.83 48.44,10.62 48.99,19.05
  pour GND15: 0,20.57 0,0.25 55.24,0.25 55.5,20.83
  pour Top: 0,20.32 0,0 55.12,0 55.12,20.32
  pour Bottom: 0,20.57 0,0.25 55.12,0 55.12,20.32
  pour GND2: 0,20.32 0,14.48 7.11,14.48 7.11,12.45 0,12.45 0,0 55.12,0 55.12,20.32
  pour GND2: 0,15.24 0,11.43 2.03,11.43 2.03,15.24
  pour 14: 0,20.57 0,0.25 55.12,0 55.12,20.32
  pour GND13: 0,20.32 0,0 55.12,0 55.12,20.32
  pour Route14: 0,20.32 0,0 55.12,0 55.12,20.32
  pour Route14: 0,20.32 0,0 55.12,0 55.12,20.32
M1_LED  (via drill 0.2)
  Top 0.157: v34.98,13.34 35.44,13.69 D1.ANODE
  Bottom 0.157: U5.42 31.46,14.52 32,13.92 34.29,13.92 v34.98,13.34
M1_RESET  (via drill 0.2)
  Top 0.157: v32.26,9.78 32.18,9.98 R47.1 32.3,10.54 L6.2 33.38,11.94 32.89,12.42 C51.1 | C24.1 31.88,14 SW1.A SW1.A2 32.77,14.16 32.36,14.07 32.36,13.11 32.64,12.95 32.69,12.95 | C51.1 32.77,12.95 32.69,12.95 | C51.1 32.69,12.95
  14 0.157: v27.41,10.16 26.52,10.19 25.38,11.07 24.77,11.07 24.26,10.77 22.66,8 21.59,6.3 21.29,6.02 21.29,5.46 21.69,5.18 22.3,5.18 v22.61,4.67
  GND13 0.157: v27.41,10.16 27.94,9.4 28.7,9.4 30.23,11.18 31.47,11.18 v32.26,9.78
  Bottom 0.157: U6.26 20.81,5.82 21.01,5.11 22.35,5.11 22.58,4.8 v22.61,4.67 | TP17.TP 28.7,14.99 29.46,14.22 29.46,13.72 28.19,12.45 28.19,12.19 U5.34 28.63,11.75 29.08,11.33 29.08,11.05 28.7,10.69 28.63,10.64 28.14,10.74 v27.41,10.16
M1_TCK_SWDCLK  (via drill 0.2)
  GND2 0.157: v13.51,7.49 13.97,7.87 23.62,7.87 23.82,7.67 24.64,7.67 25.88,7.29 26.24,7.29 27.69,5.84 32.77,5.84 33.53,6.6 v33.43,6.55
  Bottom 0.155: U5.22 31.78,5.11 31.5,4.83 | 31.14,4.67 30.84,4.93 30.23,5.13 29.23,5.33 TP4.TP
  Bottom 0.157: R54.2 14.3,7.49 v13.51,7.49 | 31.5,4.83 31.65,4.83 v33.43,6.55 | 31.14,4.67 31.43,4.72 U5.22
M1_TDI  (via drill 0.2)
  Top 0.157: R66.2 v45.59,7.39
  GND2 0.157: v23.5,10.9 23.47,9.42 22.33,8.36 15.21,8.36 v14.61,9.65
  PWR 0.157: v32.08,6.58 29.97,9.4 26.16,9.4 24.38,9.91 23.62,10.16 v23.5,10.9 22.61,9.91 21.59,9.91 21.08,10.41 18.03,10.41 16.84,8.89 15.24,8.89 v14.61,9.65
  GND13 0.157: v45.59,7.39 42.93,5.33 39.88,3.05 34.29,3.05 32.08,5.03 v32.08,6.58
  Bottom 0.157: R57.2 14.83,9.3 v14.61,9.65 | v32.08,6.58 31.98,6.04 U5.23 | TP6.TP v23.5,10.9
M1_TDO_SWO
  Bottom 0.155: U5.24 31.08,5.78 30.5,5.41 29.87,5.54 29.57,5.71 29.46,5.84 29.13,6.27 28.02,6.27 R56.2 27.58,5.74 27.28,5.11 25.91,5.11 25.81,4.29 26.42,2.92 26.59,2.85 29.11,2.85 TP7.TP
M1_TMS_SWDIO  (via drill 0.2)
  GND2 0.157: v33.22,7.64 32.77,8.13 28.45,8.13 27.94,8.64 25.91,8.64 v25.15,8.08
  Bottom 0.155: U5.25 31.5,6.86 31.9,7.77 32.54,7.9 32.82,7.67
  Bottom 0.157: TP8.TP 25.91,7.62 v25.15,8.08 24.59,7.52 R14.2 | 32.82,7.67 v33.22,7.64
M1_TX_TO_M2_RX
  Bottom 0.157: U5.49 36.33,16.78 36.83,17.27 37.34,17.58 38.05,17.58 38.89,17.12 R61.1
M2_MISO  (via drill 0.2)
  GND13 0.157: v16.26,14.48 18.29,11.43 18.29,10.67 16.51,8.13 v16.51,5.59
  Bottom 0.157: U3.2 15.88,14.86 v16.26,14.48 | U6.1 16.81,5.89 v16.51,5.59
M2_MOSI  (via drill 0.2)
  Route14 0.157: v19.79,15.6 19.51,15.42 16.79,6.73 v15.75,5.84
  Bottom 0.157: U3.5 20.45,17.4 19.81,16.76 v19.79,15.6 | U6.2 16.53,6.88 16.38,6.88 16.03,6.25 16,6.1 v15.75,5.84
M2_RESET  (via drill 0.2)
  Top 0.157: SW3.A SW3.A2 4.12,4.82 4.47,4.47 v5.08,2.85
  GND2 0.157: v30.94,15.49 27.43,14.22 25.91,13.97 25.4,13.21 24.64,13.21 v24.23,13.44
  GND13 0.157: v24.13,11.35 24.11,13.31 v24.23,13.44
  GND15 0.157: v5.08,2.85 6.91,2.85 9.14,5.08 9.14,15.24 10.67,16.51 28.19,16.51 29.46,15.49 v30.94,15.49
  Bottom 0.157: U5.41 31.1,14.36 30.56,14.91 30.56,15.16 v30.94,15.49 | U6.19 22.59,8.88 23.22,9.3 23.9,9.3 24.26,9.6 24.26,11.2 v24.13,11.35 | TP27.TP 23.62,12.95 v24.23,13.44
M2_RX  (via drill 0.2)
  14 0.157: v38.86,18.16 38.61,16.51 37.36,14.2 36.58,14.2 35.61,13.23 35.61,12.93 35.33,12.65 34.9,12.65 34.62,12.85 30.15,12.85 29.46,11.43 28.83,9.96 28.52,9.63 27.84,9.6 26.39,9.6 26.06,9.78 24.41,9.78 23.88,8.89 v22.91,5.79
  Bottom 0.157: R61.2 40.01,17.45 39.78,17.73 39.52,18.14 v38.86,18.16 | U6.24 22.58,6.38 v22.91,5.79
M2_SCK  (via drill 0.2)
  GND13 0.157: v19.81,14.48 20.83,13.72 20.83,12.19 20.07,11.68 19.3,11.12 19.28,6.43 18.36,5.84 v18.36,4.57
  Bottom 0.157: U3.6 20.83,15.83 19.81,14.81 v19.81,14.48 | U6.30 18.81,5.83 18.8,5.84 18.8,5.26 18.36,4.93 v18.36,4.57
M2_SPI0_MISO  (via drill 0.2)
  Route14 0.157: v27.33,8 28.96,9.4 28.96,10.44 28.45,10.92 28.22,11.15 24.99,11.15 24.38,10.85 23.72,9.96 21.74,9.96 20.8,11.1 20.83,13.72 21.36,14.07 20.5,16.1 19,16.36 17.78,12.95 15.49,11.68 15.44,11.1 15.42,10.49 v15.44,9.73
  Bottom 0.157: U6.6 16.41,8.89 16.01,9.26 v15.44,9.73 | R56.1 26.77,5.92 25.5,5.92 25.45,6.04 25.45,6.83 25.58,6.96 26.54,6.93 27.18,7.62 v27.33,8
M2_SPI0_MOSI
  Bottom 0.157: U6.5 16.08,8.38 R57.1
M2_SS  (via drill 0.2)
  Route14 0.157: v14.22,14.1 14.22,13.97 13.97,13.72 13.97,8.89 12.42,8.2 12.42,4.9 13.97,3.81 16.76,3.81 18.29,5.59 19.3,5.59 v19.84,4.57
  Bottom 0.157: U3.1 14.86,13.59 v14.22,14.1 | U6.29 19.31,5.59 v19.84,4.57
M2_TCK_SWDCLK
  Bottom 0.157: TP14.TP 18.36,11.66 18.29,11.48 18.29,10.9 U6.10
M2_TMS_SWDIO
  Bottom 0.157: TP2.TP 20.57,12.19 19.81,11.46 19.81,10.88 U6.13
M2_TX  (via drill 0.2)
  GND15 0.157: v21.89,5.74 24.84,9.58 25.4,9.65 28.7,14.22 31.24,14.22 32.44,17.17 32.44,17.96 32.28,18.06 31.73,18.31 31.06,17.88 v29.92,16.51
  Bottom 0.157: R62.2 29.87,16.26 v29.92,16.51 | U6.25 v21.89,5.74
M2_TX_TO_M1_RX  (via drill 0.2)
  Top 0.157: v31.14,16.23 30.56,17.02 30.56,17.91 v31.24,18.64
  Bottom 0.157: U5.46 32.77,15.99 32.46,16.64 32.46,16.71 32.44,16.97 32.46,17.09 32.44,17.98 31.8,18.29 31.65,18.47 31.42,18.47 v31.24,18.64 | R62.1 29.72,15.14 30.15,15.16 30.71,16.2 30.73,16.23 v31.14,16.23
M2_UBLOX_RX  (via drill 0.2)
  14 0.157: v13.74,14.86 14.73,14.86 14.99,14.61 14.99,13.72 13.97,12.95 13.97,11.94 12.19,10.16 12.19,5.59 12.45,5.08 v15.75,5.08
  Bottom 0.157: R63.1 18.29,3.05 17.8,2.67 17.04,2.67 16.26,3.3 16.26,3.56 15.75,4.06 v15.75,5.08 | U8.P$2 11.48,16.56 11.68,16.61 13.56,16.61 14.38,16.36 14.35,15.11 | 14.35,15.11 v13.74,14.86 | TP24.TP 16.08,12.19 16.08,13.95 14.76,14.4 14.35,14.66 14.35,15.11
M2_UBLOX_TX  (via drill 0.2)
  PWR 0.157: v16.36,4.55 15.75,4.32 13.46,4.32 12.45,5.31 12.45,9.91 13.97,11.43 13.97,12.7 12.45,13.77 12.45,15.75 13.46,16.84 v13.46,18.75
  Bottom 0.157: R64.1 16.92,3.4 16.51,3.81 16.51,4.32 v16.36,4.55 | U8.P$1 11.08,16.67 11.94,17.27 TP23.TP v13.46,18.75
N$1
  Bottom 0.157: U19.2 47.5,16.76 C20.1 47.85,17.02 47.6,17.27 R45.1
N$3
  Bottom 0.157: U19.3 47.09,16.26 47.11,16.25 47.3,16.25 C27.2 47.85,15.6 47.48,15.26 47.4,15.24 R4.2
N$4  (via drill 0.2)
  Bottom 0.157: U1.9 52.12,6.22 52.1,9.24 51.71,9.5 50.98,9.5 50.61,9.78 49.48,9.78 49.4,10.01 48.05,10.01 47.44,9.96 | v46.13,10.69 46.97,10.44 47.44,9.96 | 47.44,9.96 J2.3 | 49.09,3.75 49.09,3.62 48.51,3.05 48.51,2.39 R15.2
  Bottom 0.305: U1.1 49.09,3.75 | U1.2 49,4.3 48.77,4.06
  Bottom 0.406: R6.2 45.41,6.17
  Bottom 0.457: 48.51,6.17 48.23,6.53 47.62,6.86
  Bottom 0.61: 45.41,6.17 45.47,6.22 45.47,6.4 45.87,6.68 47.24,6.71 47.62,6.86 J2.3 | 49.09,3.75 48.77,4.06 48.51,4.32 48.51,6.17
N$5
  Bottom 0.157: U1.8 51.45,6.62 R10.1 51.54,6.73 51.03,7.29 50.98,7.49 R2000.2
N$6  (via drill 0.2)
  Top 0.157: v53.95,0.66 53.95,1.17 53.59,1.52 53.59,9.58 53.11,10.01 50.98,10.03 49.99,9.25 v49.2,9.25
  Bottom 0.157: U1.12 51.88,3.75 52.07,3.61 52.45,3.3 53.59,3.3 53.7,3.15 53.7,1.52 53.95,1.17 v53.95,0.66 | v49.2,9.25 49.58,9.47 50.48,9.47 50.8,9.14 51.08,8.94 C5.1 51.56,8.45 R10.2
N$7
  Top 0.157: 1.63,18.73 D3.CATHODE R3.1
N$8
  Bottom 0.157: U1.15 50.3,2.7 R7.2
N$9
  Bottom 0.305: U2.9 U2.8 50.22,15.93 50.29,16 50.44,16.03 51.13,16.79 51.21,17.05 L5.P$1
N$10
  Bottom 0.157: U1.16 49,3 49.01,1.94 48.87,1.65 48.87,1.07 R8.2
N$11
  Bottom 0.155: X1.XTAL1 25.96,11.75 C30.1 25.66,10.62 R5.2 26.45,9.87 27.43,8.89 28.02,8.89 U5.32
N$12
  Bottom 0.157: U1.13 51.62,3.25 51.74,3.05 52.12,3.05 52.17,2.97 52.22,2.82 52.22,1.5 52.48,1.25 R9.2
N$13
  Top 0.157: R41.1 D5.CATHODE
N$14
  Bottom 0.157: U1.5 49.29,6.04 C22.1
N$17  (via drill 0.2)
  Top 0.157: v36.58,6.71 36.32,7.37 36.07,7.79 L1.1
  Bottom 0.157: C8.1 43.03,6.06 C10.1 | v36.58,6.71 37.01,7.24 37.77,7.87 38.35,7.95 38.63,8.31 38.86,8.56 39.4,9.07 39.78,9.07 40.8,8.09 U5.3 41.06,7.86 41.78,7.32 42.24,6.86 C8.1 | R16.2 43.03,7.59 C8.1
N$18
  Bottom 0.155: U5.30 28.98,7.9 28.55,7.52 28.47,7.39 27.91,7.39 C7.1 27.23,6.86 27.18,6.86 R17.2
N$19  (via drill 0.2)
  14 0.157: v33.73,17.6 33.45,17.32 32.59,17.32 32.44,17.48 32.44,17.96 32.23,18.09 31.73,18.31 31.09,17.91 v29.62,17.88
  Bottom 0.157: C4.1 29.67,17.83 v29.62,17.88 29.62,17.58 29.67,17.48 29.67,17.07 29.46,16.87 29.18,16.48 R18.2 | U5.48 v33.73,17.6
N$20  (via drill 0.2)
  Top 0.157: U4.3 39.46,9.65 38.86,9.65 38.1,8.61 v38.1,7.37 38.1,5.84 37.67,4.9 C18.1
  Bottom 0.157: U5.8 38.22,7.07 v38.1,7.37
N$21
  Bottom 0.157: U5.7 39.52,6.46 39.95,6.04 39.98,5.26 R20.2
N$22  (via drill 0.2)
  Top 0.157: v34.67,2.44 34.59,2.49 33.86,2.49 33.63,2.77 C15.1
  Bottom 0.157: U5.17 33.85,3.34 v34.67,2.44
N$23  (via drill 0.2)
  Top 0.157: v38.58,4.06 38.17,4.35 36.68,4.35 35.84,5.16 35.28,5.16 34.94,5.5 C13.1 34.11,5.11 R19.1 32.84,4.85 32.59,4.95 32.61,6.02 32.74,6.55 32.97,6.88 33.25,7.09 33.73,7.11 33.83,7.92 34.29,8.13 34.8,8.64 34.95,8.64 35.81,9.4 L1.2
  Bottom 0.157: U5.13 37.46,4.35 37.9,3.91 v38.58,4.06
N$25
  Top 0.457: L2.2 42.94,11.87 U4.2
  Top 0.61: U4.2 U4.1
N$27  (via drill 0.2)
  Top 0.155: v32.36,7.32 32.11,7.24 32.05,7.24 | 31.47,5.97 C9.1
  Top 0.157: 31.47,5.97 R21.2 32.05,7.24
  Bottom 0.155: U5.21 32.18,4.75 33.96,6.1 34.04,6.53 34.09,6.86 33.73,7.11 32.61,7.09 v32.36,7.32
N$28
  Bottom 0.155: X1.XTAL2 C31.1 28.61,13.33 28.5,13.21 26.59,11.3 26.67,10.73 R5.1 27.94,11.43 27.94,11.73 U5.33
N$29  (via drill 0.2)
  Top 0.155: v31.09,1.93 31.29,3.33 v31.39,4.04
  Bottom 0.155: X2.P$2 28.57,3.86 C23.1 29.44,4.06 29.65,4.22 29.96,4.34 R38.2 30.59,4.6 30.73,4.6 v31.39,4.04 | U5.19 32.75,3.92 32.49,3.53 32.44,3 32.64,2.36 v31.09,1.93
N$30
  Bottom 0.157: U6.20 22.6,8.38 23.39,8.97 24.08,8.97 R58.1
N$31
  Bottom 0.155: U5.20 32.46,4.35 31.75,3.5 31.04,3.48 R38.1 | X2.P$1 25.01,3.43 26.06,2.52 30.05,2.52 30.66,3.02
  Bottom 0.157: R38.1 C17.1 30.66,3.02
N$32
  Bottom 0.305: L5.P$2 49.95,16.42 49.53,16 49.53,15.24 49.28,14.99 47.75,14.99 47.7,14.4 47.5,14.03 U2.7 U2.6
N$33
  Top 0.157: D1.CATHODE 36.67,13.81 36.32,13.46 36.32,12.98 R26.1
N$35
  Bottom 0.157: U6.22 23.23,7.38 R14.1
N$36
  Bottom 0.157: U1.14 50.98,3.04 50.98,2.92 51.16,2.72 51.41,2.44 R28.2 51.31,2.29 49.63,2.29 49.43,2.13 R15.1
N$37
  Bottom 0.157: U1.7 50.9,6.61 R46.2
N$38
  Bottom 0.356: U2.4 46.81,12.52 R69.2 R67.1 46.72,12.95 U2.5
N$40
  Bottom 0.157: U6.31 18.26,5.33 17.82,5.01 17.82,4.55 17.83,4.06 R63.2
N$41
  Bottom 0.157: U6.32 17.67,5.73 17.27,5.59 17.05,5.31 17.04,4.75 17.25,4.57 R64.2
N$42
  Bottom 0.157: U6.3 16.29,7.38 R55.1
N$43
  Bottom 0.157: U6.4 15.75,7.88 R54.1
N$48
  Bottom 0.157: U6.21 22.71,7.88 R59.1
N$51  (via drill 0.2)
  Top 0.157: v17.02,11.43 17.53,11.18 21.92,11.18 v22.07,11.33
  Bottom 0.157: U6.15 20.81,11.16 20.83,11.43 21.59,11.66 21.77,11.84 21.77,12.07 | 21.77,12.07 C28.1 | R60.2 15.32,11.84 15.65,11.53 16.43,11.53 16.61,11.94 C3.1 16.87,11.58 v17.02,11.43 16.76,11.18 16.51,10.67 16.2,10.21 16.2,9.55 16.4,9.38 U6.7 | v22.07,11.33 22.07,11.77 21.77,12.07
N$56
  Top 0.157: R65.1 1.85,3.92 D7.CATHODE
N$57
  Bottom 0.155: U6.18 22.59,9.38 22.94,9.65 22.94,11.07 23.11,11.43 24.05,11.96 24.36,12.27 24.43,12.83 24.51,12.93 25.53,13.95 25.55,14.63 R39.1 25.57,14.75 26.16,15.24 26.54,15.39 27.2,15.39 27.69,16 C32.1 28.09,16.51 X3.P$1
N$58
  Bottom 0.155: U6.17 22.61,10.22 22.63,11.48 22.94,11.79 22.94,13.59 23.37,13.97 | X3.P$2 23.9,16.23 24.77,15.37 24.77,14.76 R39.2
  Bottom 0.157: 23.37,13.97 23.95,13.97 23.95,13.99 C29.1 24.77,14.73 24.77,14.68 R39.2
N$59  (via drill 0.2)
  Top 0.157: v51.46,13.51 51.31,13.46 50.55,12.7 48.39,12.7 46.48,11.89 46.48,11.66 v46.69,11.51
  Bottom 0.157: 50.4,11.45 U2.13 U2.12 50.93,11.94 51.16,12.14 51.33,12.45 51.28,12.27 C48.1 | U2.1 46.89,11.15 v46.69,11.51 | C48.1 51.26,13.11 v51.46,13.51 | 51.16,12.32 C48.1
N$61
  Bottom 0.157: U2.3 47.07,12.04 46.32,12.05 R69.1 45.97,12.47 45.85,12.5 45.85,12.09 R70.2
UBLOX_1.8V_SUPPLY  (via drill 0.2)
  Top 0.157: v10.92,0.84 10.92,1.78 10.16,2.29 10.16,3.29 U420.4
  Bottom 0.157: R49.1 8.48,15.01 8.64,14.91 9.65,14.33 9.65,12.45 7.62,10.92 7.62,6.1 10.92,2.79 v10.92,0.84
UBLOX_ANT
  Top 0.157: 4.08,13.46 ANT_UFL.SIGNAL
  Top 0.272: U420.56 4.08,13.46
UBLOX_PWR_IN  (via drill 0.2, 0.6, 0.8)
  Top 0.157: D3.ANODE 2.76,18 2.54,17.78 1.52,17.78 0.76,17.02 v0.76,16.26
  Top 0.457: R27.2 40.92,17.22 J9.4 J9.2 38.86,15.75 38.35,15.24 38.35,14.99 37.69,14.99 R22.2
  Top 0.61: J9.2 38.86,17.27 38.51,17.27 38.28,17.5 37.97,17.78 36.58,17.78 v36.32,18.03
  14 0.457: v36.32,18.03 36.58,17.65 36.6,16.92 36.27,16.28 35.56,16.28 35.08,16.56 34.54,16.56 32.31,14.38 26.21,14.38 23.93,17.32 6.55,17.35 6.1,17.78 4.95,17.78 4.62,17.45 v3.35,17.45
  Bottom 0.157: v0.76,16.26 C47.1 TP28.TP
  Bottom 0.457: v3.35,17.45 3.3,16.51 C47.1
  Bottom 0.61: C47.1 3.38,16.18 3.56,16 3.71,16 C39.2 | C39.2 C6.2 | C6.2 C40.2 6.62,15.65 L7.1 | C46.2 4.32,15.9 | 4.32,15.9 C39.2 | 4.32,15.9 4.57,15.9 C6.2
UBLOX_PWR_ON  (via drill 0.2)
  Top 0.157: U420.15 22.18,2.71 22.78,2.21 22.96,2.21 v23.72,0.86
  14 0.157: v19.63,12.45 19.63,5.77 23.02,2.13 v23.72,0.86
  Bottom 0.157: R51.2 21.44,3.35 21.84,3.05 22.1,2.85 23.11,1.96 23.37,1.7 23.37,1.35 23.72,0.99 v23.72,0.86 | U6.11 18.8,10.88 18.8,11.1 19.05,11.61 v19.63,12.45
UBLOX_RESET_N  (via drill 0.2)
  Top 0.157: U420.18 25.48,2.46 v26.16,1.78 | L6.1 33.27,9.92 C43.1 | C43.1 34.54,11.18 | C43.1 v35.2,11.89
  14 0.157: v35.2,11.89 34.67,11.51 30.68,11.51 30.2,10.77 29.18,8.99 26.16,8.99 25.4,9.45 24.74,9.45 24.56,9.32 24.33,8.99 24.31,8.91 24.31,7.21 24.31,4.24 v26.16,1.78
UBLOX_RXD  (via drill 0.2)
  Top 0.157: U420.13 19.98,2.45 20.07,2.29 20.47,2.29 v20.83,1.98
  PWR 0.157: v16,0.76 16,1.27 15.98,1.29 15.82,1.47 15.65,1.98 15.65,2.54 15.9,2.74 20.47,2.74 v20.83,1.98
  Bottom 0.157: U8.P$11 11.48,14.07 10.92,13.39 10.92,11.68 10.98,10.47 TP22.TP | TP22.TP 10.92,9.91 | v16,0.76 16,1.27 15.75,1.52 15.75,1.78 15.24,2.29 13.89,2.29 10.77,5.59 TP22.TP
UBLOX_SARA_USB_D_N
  Top 0.157: U420.28 31.26,11.26 31.26,11.43 U$2.P$1
UBLOX_SARA_USB_D_P
  Top 0.157: U420.29 31.5,12.36 U$1.P$1
UBLOX_SIM_CLK  (via drill 0.2)
  Top 0.157: v1.02,7.11 C42.1 | U420.38 23.28,17.95 23.62,18.29 v23.62,18.54
  GND2 0.157: v1.02,7.11 8.64,7.11 9.4,7.87 9.4,16 9.91,16.51 22.86,16.51 23.62,17.78 v23.62,18.54
  Bottom 0.157: SIM1.C3 1.61,6.18 v1.02,7.11
UBLOX_SIM_IO  (via drill 0.2)
  Top 0.157: U420.39 22.18,12.87 22.86,11.94 22.86,9.4 21.84,8.13 13.21,8.13 12.95,7.87 12.95,6.93 v13.01,6.88
  Bottom 0.157: C44.1 14.08,3.95 13.46,4.57 13.46,5.78 SIM1.C7 13,6.16 v13.01,6.88
UBLOX_SIM_RST  (via drill 0.2)
  Top 0.157: C41.1 v0.76,8.38 | U420.40 v21.08,18.54
  GND2 0.157: v0.76,8.38 7.87,8.38 8.64,9.14 8.64,16.76 9.14,17.35 20.32,17.35 v21.08,18.54
  Bottom 0.157: v0.76,8.38 1.89,8.38 SIM1.C2
UBLOX_SIM_VSIM  (via drill 0.2)
  Top 0.157: U420.41 19.98,16.68 18.8,15.49 18.8,13.97 17.78,12.95 15.24,12.95 v14.99,12.7 | C45.1 v1.02,9.65
  Route14 0.157: v1.02,9.65 12.95,9.65 v13.21,9.47
  Bottom 0.157: SIM1.C6 13.61,9 v13.21,9.47 13.13,9.47 12.7,9.91 12.7,11.68 13.21,12.19 14.12,12.19 C2.1 14.73,12.55 v14.99,12.7 | SIM1.C1 2.2,11 v1.02,9.65
UBLOX_TXD  (via drill 0.2)
  Top 0.157: U420.12 18.88,2.37 v18.54,1.98
  GND15 0.157: v13.46,0.76 13.46,2.29 13.72,2.54 17.98,2.54 v18.54,1.98
  Bottom 0.157: U8.P$12 11.07,14.1 10.32,13.32 10.32,11.92 9.91,11.43 TP21.TP 8.43,6.3 9.65,5.08 11.68,3.3 12.95,2.29 13.46,1.78 v13.46,0.76
UBLOX_USB_DET  (via drill 0.2)
  Top 0.157: U420.17 24.13,2.96 24.13,3.86 23.77,4.19 v23.44,4.47
  Bottom 0.157: R32.1 23.11,4.06 23.37,4.32 v23.44,4.47
UBLOX_V_BCKP  (via drill 0.2)
  Top 0.157: U420.2 7.88,2.28 v8.38,1.78
  14 0.157: v16.26,1.96 15.24,2.29 8.89,2.29 v8.38,1.78
  Bottom 0.157: R51.1 19.68,2.56 18.34,2.56 18.03,2.29 16.54,2.29 v16.26,1.96 | v8.38,1.78 8.38,2.01
UBLOX_VCC  (via drill 0.6)
  Top 0.61: U420.51 U420.52 U420.53 5.98,17.11 v5.59,16.71
  Bottom 0.61: L7.2 5.73,16.85 v5.59,16.71 5.98,17.11 5.84,17.25 TP30.TP
UBLOX_WAKE_M2  (via drill 0.2)
  Top 0.157: U420.23 30.31,5.76 30.73,5.26 30.73,3.35 29.82,2.59 29.31,2.13 28.88,2.13 v28.73,1.93
  14 0.157: v24.94,7.01 29.21,5.59 29.21,2.54 v28.73,1.93
  Bottom 0.157: R12.2 24.33,6.38 24.59,6.88 24.82,7.11 v24.94,7.01
USB_5V
  Top 0.457: J1.VCC 48.42,4.29 F6.1 47.84,1.36 JLEFT_A.6
  Bottom 0.157: TP1.TP 42.11,3.1 42.67,2.54 43.18,2.54 43.69,2.29 45.85,2.29 46.63,1.27 JLEFT_A.6
USB_D_N  (via drill 0.2)
  Top 0.157: RN1.7 45.21,5.18 44.73,5.56 42.04,5.56 41.96,5.64 U9.1 41.99,6.06 41.07,6.75 40.7,7.29 39.56,7.43 39.23,7.78 v38.91,7.77
  Bottom 0.157: U5.6 39.12,7.62 v38.91,7.77
USB_D_P  (via drill 0.2)
  Top 0.157: RN1.6 46.11,5.96 45.72,6.1 43.43,6.1 U9.2 41.91,7.57 41.66,7.32 41.18,7.55 40.49,7.65 39.97,7.72 39.78,8.03 39.59,8.24 v39.47,8.36
  Bottom 0.157: v39.47,8.36 39.62,7.83 U5.5
USB_ID
  Top 0.157: J1.ID 48.63,6.24 48.26,6.6 48.26,7.11 47.75,7.62 47.4,7.62 R66.1 47.45,9.1 U7.2
USB_IN  (via drill 1.57)
  Top 0.157: F6.2 46.74,3.3 46.86,3.58 46.86,7.14 47.04,7.37 47.04,8.43 46.86,8.56 45.21,8.56 44.65,9.4 44.56,9.5 U7.1
  Top 0.457: v44.04,3.73 43.36,3.73 42.93,3.3 42.4,3.3 C11.1 | C12.1 43.46,4.32 v44.04,3.73 | F6.2 44.48,3.3 v44.04,3.73
  Bottom 0.305: R13.1 44.09,6.6
  Bottom 0.406: 44.09,6.6 44.09,6.27
  Bottom 0.457: 43.99,5.44 TP5.TP | 43.99,5.44 44.09,6.27 | 43.99,5.44 R6.1
  Bottom 0.61: J2.4 J2.2 46.36,3.26 C1.1 44.95,3.73 v44.04,3.73 44.12,3.73 44.96,4.57 R6.1
USB_IN_D_N
  Top 0.157: J1.D- 47.97,4.94 RN1.2
USB_IN_D_P
  Top 0.157: J1.D+ 48.51,5.59 48.26,5.84 47.86,5.84 RN1.3
USER01  (via drill 0.2)
  Route14 0.157: JLEFT_B.1 19.81,2.79 24.38,3.56 27.43,6.86 v31.04,9.7
  Bottom 0.155: U5.29 29.42,7.58 30.48,8.64 30.5,9.17 31.01,9.68 31.04,9.68 v31.04,9.7
USER02  (via drill 0.2)
  Route14 0.157: JLEFT_B.2 22.35,2.34 26.42,3.56 27.43,4.83 28.47,5.99 28.83,5.97 29.31,6.48 29.23,6.93 v31.24,8.89
  Bottom 0.155: U5.28 29.69,7.33 v31.24,8.89
USER03  (via drill 0.2)
  Route14 0.157: JLEFT_B.3 24.89,2.21 29.46,4.06 30.71,5.79 30.73,5.82 31.14,6.45 31.06,6.71 32.44,8.71 32.77,8.79 v32.77,8.81
  Bottom 0.155: U5.27 30.04,6.93 31.42,8.23 31.73,8.48 32.38,8.53 32.64,8.84 v32.77,8.81
USER04  (via drill 0.2)
  Route14 0.157: v42.56,8.53 42.67,8.13 42.67,5.33 42.16,4.57 42.16,2.03 JLEFT_A.4
  Bottom 0.157: v42.56,8.53 41.86,8.81 U5.1
USER05  (via drill 0.2)
  Route14 0.157: JLEFT_A.3 40.13,2.79 41.28,3.95 41.28,8.82 40.59,9.45 v40.18,9.78
  Bottom 0.157: U5.2 41.09,8.46 40.28,9.27 v40.18,9.78
USER06  (via drill 0.2)
  Route14 0.157: JLEFT_C.6 17.27,1.96 20.57,4.06 20.57,6.1 21.84,6.6 22.61,8.64 23.32,9.14 23.57,9.4 27.69,9.4 v28.27,10.16
  Bottom 0.157: U5.35 29.04,12.11 29.72,11.43 29.72,11.18 28.8,10.24 28.55,10.24 v28.27,10.16
USER07  (via drill 0.2)
  Route14 0.157: JLEFT_B.4 27.43,1.98 30.1,3.43 30.1,3.94 31.09,5.28 32.31,5.28 34.29,6.1 v34.29,8.89
  Bottom 0.157: U5.36 29.33,12.32 29.97,11.68 31.29,11.68 32.13,10.85 32.74,10.85 v34.29,8.89
USER08  (via drill 0.2)
  Route14 0.157: v19.1,4.8 19.05,4.06 17.48,3.05 15.19,3.05 14.73,2.54 JLEFT_C.5
  GND15 0.157: v19.1,4.8 19.1,3.96 19.63,3.25 29.06,3.23 30.15,4.8 32.28,4.8 v33.35,2.26
  Bottom 0.155: U5.18 32.77,3.02
  Bottom 0.157: 32.77,3.02 v33.35,2.26
USER09  (via drill 0.2)
  Route14 0.157: JRIGHT_B.5 30.46,18.19 30.48,16.26 30.07,15.8 30.07,15.06 30.46,14.73 32.66,14.73 33.07,15.04 v34.87,15.04
  Bottom 0.157: U5.45 32.59,15.59 32.92,15.27 33.07,15.14 34.09,15.6 v34.87,15.04
USER10  (via drill 0.2)
  Top 0.157: v31.83,17.68 JRIGHT_B.6
  Bottom 0.157: U5.44 32.16,15.34 31.75,15.75 31.83,16.1 32.13,16.41 32.11,16.69 32.05,17.2 31.95,17.55 v31.83,17.68
USER11  (via drill 0.2)
  Route14 0.157: JRIGHT_B.4 27.43,16.69 30.35,14.12 32.97,14.12 33.17,14.28 v34.9,14.28
  Bottom 0.157: U5.43 32.26,14.48 32.74,14.25 34.52,14.25 v34.9,14.28
USER12  (via drill 0.2)
  Route14 0.157: JRIGHT_A.1 34.29,18.03 34.29,16.76 35.31,16.26 36.32,16 37.11,16 37.41,15.57 37.41,13.87 v36.93,13.16
  Bottom 0.157: U5.53 37.64,15.29 37.08,14.73 v36.93,13.16
USER13  (via drill 0.2)
  Route14 0.157: JLEFT_A.2 37.62,4.22 40.28,7.47 40.77,8.05 40.77,8.76 40.39,9.17 38.86,9.42 38.05,10.21 v38.05,10.74
  Bottom 0.157: U5.58 39.43,13.52 38.86,12.95 38.86,12.72 38.18,11.91 38.08,10.77 v38.05,10.74
USER14  (via drill 0.2)
  Route14 0.157: v37.69,9.25 40.03,8.81 40.03,8.03 37.85,5.33 37.29,4.6 36.73,4.6 35.81,3.68 35.81,2.26 JLEFT_A.1
  Bottom 0.157: U5.59 39.74,13.05 38.61,11.68 38.61,10.52 v37.69,9.25
USER15  (via drill 0.2)
  Route14 0.157: JLEFT_B.5 29.97,2.29 30.48,2.62 30.48,3.81 31.24,4.83 32.36,4.83 33.27,5.26 34.65,5.82 34.65,8.33 36.07,9.14 v36.93,9.14
  Bottom 0.157: U5.60 40.22,12.79 38.94,11.51 38.94,10.34 39.09,10.19 39.19,9.86 38.1,8.71 37.31,8.61 v36.93,9.14
USER16  (via drill 0.2)
  Route14 0.157: v41.22,13.72 39.88,13.72 39.24,14.17 39.24,15.7 40.13,17.02 JRIGHT_A.3
  Bottom 0.157: U5.61 40.65,12.46 40.89,12.88 41.05,13.41 v41.22,13.72
USER17  (via drill 0.2)
  Route14 0.157: v36.96,7.92 35.64,7.92 35.46,7.75 35.05,7.37 35.05,5.46 33.53,4.83 33.53,3.3 32.49,2.21 JLEFT_B.6
  Bottom 0.157: U5.62 40.71,11.88 40.41,11.58 39.88,11.84 39.27,11.28 39.27,10.49 39.5,10.26 39.62,9.78 38.2,8.33 37.72,8.26 37.39,8.15 37.29,8.1 v36.96,7.92
USER18  (via drill 0.2)
  Route14 0.157: v41.5,12.95 39.88,12.95 38.86,13.72 38.61,13.97 38.61,17.27 37.59,18.03 JRIGHT_A.2
  Bottom 0.157: U5.63 41.37,11.83 41.73,12.39 v41.5,12.95
USER19  (via drill 0.2)
  GND13 0.157: v39.83,10.85 43.51,10.85 44.48,11.71 44.48,16.82 43.43,18.03 JRIGHT_A.4
  Bottom 0.157: U5.64 41.12,10.89 v39.83,10.85
USER20  (via drill 0.2)
  GND13 0.157: v37.47,6.4 36.83,7.37 36.45,7.37 35.56,8.51 35.56,10.41 34.16,11.2 32.66,12.22 26.04,12.22 24.51,10.77 22.35,8.38 22.1,8.13 20.83,8.13 20.14,7.57 20.14,6.02 20.57,5.59 20.62,4.7 20.3,4.04 20.19,4.04 17.8,3.99 17.14,3.99 16.48,3.96 14.33,3.96 12.95,5.33 8.64,5.33 4.57,15.75 JRIGHT_C.1
  Bottom 0.157: U5.9 38.81,5.89 38.1,6.6 37.85,6.6 v37.47,6.4
USER21  (via drill 0.2)
  GND13 0.157: v36.78,5.64 35.71,5.11 35.1,5.11 34.44,5.69 34.44,7.59 34.04,7.87 33.6,8.2 32.33,8.2 31.24,6.86 29.21,3.81 25.4,3.81 23.65,6.38 21.29,6.38 20.73,3.61 6.73,3.68 JLEFT_C.1
  Bottom 0.157: U5.12 37.67,4.75 37.08,5.33 36.96,5.51 v36.78,5.64
USER22  (via drill 0.2)
  Top 0.157: R1.2 34.24,17.8 v33.78,18.54
  14 0.157: v33.78,18.54 34.29,17.78 34.29,17.14 32.05,14.94 30.25,14.94 27.18,17.8 25.4,17.8 JRIGHT_B.3
USER23  (via drill 0.2)
  Route14 0.157: v35.66,14.96 35.84,13.89 35.51,12.75 35,12.7 34.49,12.95 33.88,13.56 29.9,13.56 25.17,17.78 18.14,17.78 JRIGHT_C.6
  Bottom 0.157: U5.51 36.92,15.92 36.52,15.49 35.94,15.52 v35.66,14.96
USER24  (via drill 0.2)
  Route14 0.157: v36.42,14.81 35.81,11.18 34.29,11.18 32.51,13.21 29.72,13.21 24.92,17.25 18.8,17.27 14.78,17.93 JRIGHT_C.5
  Bottom 0.157: U5.52 37.4,15.55 36.5,14.83 v36.42,14.81
USER25  (via drill 0.2)
  Top 0.157: R11.1 36.02,15.72 v34.87,15.8
  GND13 0.157: v34.87,15.8 32.31,15.8 31.24,14.73 29.64,14.73 27.13,17.63 22.48,17.63 22.35,17.78 JRIGHT_B.2
USER26  (via drill 0.2)
  Route14 0.157: v36.93,12.39 36.5,11.96 36.32,10.67 33.78,10.67 32.26,12.19 25.65,12.19 25.15,12.7 23.55,12.7 20.73,16.56 13.21,17.68 12.19,17.78 JRIGHT_C.4
  Bottom 0.157: U5.55 37.85,13.97 37.54,13.61 37.49,13.34 37.47,12.93 37.11,12.37 v36.93,12.39
USER27  (via drill 0.2)
  GND13 0.157: JRIGHT_C.2 7.87,18.03 9.91,14.73 12.19,14.73 12.95,13.46 14.99,13.46 15.24,13.72 15.24,16.13 15.62,16.51 20.07,16.51 20.47,16.1 23.82,16.1 24.64,14.73 26.31,14.73 27.71,12.62 32.71,12.62 35.03,11.25 36.07,10.67 36.07,9.04 36.5,8.48 38.61,8.48 39.12,8.89 39.12,13.46 39.88,14.22 v39.88,14.71
  Bottom 0.157: U5.56 38.87,14.23 39.4,14.78 39.47,14.83 v39.88,14.71
USER28  (via drill 0.2)
  GND13 0.157: v38.02,13.18 37.34,13.72 36.55,13.72 36.09,12.98 35.71,12.6 35.33,12.6 34.44,12.93 34.04,13.49 30.12,13.49 27.05,17.12 21.72,17.12 21.59,17.27 10.16,17.27 JRIGHT_C.3
  Bottom 0.157: U5.57 39.02,13.87 38.35,13.21 38.05,13.21 v38.02,13.18
USER29  (via drill 0.2)
  GND13 0.157: JLEFT_C.4 12.95,2.54 22.84,2.54 v23.82,2.01
  Bottom 0.157: 22.69,6.88 U6.23 22.33,6.86 22.86,6.86 R12.1 24.05,5.59 24.05,3.81 23.88,3.56 v23.82,2.01
USER30  (via drill 0.2)
  Top 0.157: U420.24 29.47,6.86 28.8,6.35 28.68,6.22 27.56,6.22 27.18,5.84 27.18,5.82 26.52,5.69 23.8,5.69 v23.44,5.23
  GND13 0.157: v23.44,5.23 24.13,4.57 24.13,4.06 22.1,3.28 8.13,3.17 JLEFT_C.2
USER31  (via drill 0.2)
  Top 0.157: U420.25 30.37,7.96 30.73,7.54 30.73,6.78 31.06,6.45 31.06,5.08 31.6,4.57 31.75,4.52 32.26,4.04 32.28,3.4 32.44,3.25 32.46,2.56 32.16,2.34 31.75,2.06 v31.24,0.89
  GND13 0.157: JLEFT_C.3 10.41,2.87 30.48,2.95 31.7,2.34 31.73,2.03 v31.24,0.89
VBATT  (via drill 0.41, 0.46, 1.57)
  Top 0.157: D5.ANODE 49.55,19.56 49.4,19.66 48.44,19.66 JRIGHT_A.6 | J20.BAT 43.75,13.66 43.69,13.72
  Top 0.305: 43.75,13.66 43.69,12.95 43.69,11.68 43.64,10.82 43.64,10.78 L2.1
  Top 0.457: v44.81,8 43.27,8.38 43.27,9.77 43.18,10.16 L2.1 | v41.91,15.27 41.81,16.71 R27.1
  Top 0.61: J9.3 40.13,12.72 40.72,14.68 v41.91,15.27 42.39,15.27 43.69,13.72
  PWR 0.457: v44.81,8 45.09,8 45.21,8.13 46.99,8.13 51,8.1 53.87,11.66 53.87,12.83 v54.3,13.66
  PWR 0.61: JRIGHT_A.6 47.75,17.27 46.23,15.75 43.92,15.75 v41.91,15.27
  Bottom 0.305: 48.42,18.39 JRIGHT_A.6
  Bottom 0.457: R71.1 53.95,13.56 54.13,13.54 v54.3,13.66 | R13.2 44.86,7.11 44.88,7.82 44.93,7.87 v44.81,8 45.45,8.55 J2.1
  Bottom 0.61: F3.1 52.7,8.28 52.73,9.42 52.02,10.03 | 52.02,10.03 51.89,10.01 TP13.TP | 52.02,10.03 52.38,10.01 52.76,10.39 53.01,10.92 54.3,11.25 v54.3,13.66
VBATT_+3.3V
  Bottom 0.305: R71.2 51.99,14.17 51.31,14.17 | 51.31,14.17 50.85,13.92 50.85,13.31 50.47,12.7 U2.11 U2.10 50.54,12.95 | C34.1 51.31,14.31 51.36,14.25 51.31,14.17
  Bottom 0.61: C33.1 51.52,14.53 C34.1
VBATT_OUT  (via drill 0.2)
  Route14 0.157: v46.48,18.29 46.48,16.51 52.73,10.26 v53.65,10.26
  Bottom 0.157: 52.94,4.85 53.59,4.85 53.74,5 53.74,5.05 53.75,10.21 53.72,10.26 v53.65,10.26 | R45.2 48.42,17.88 48.26,18.03 46.74,18.03 v46.48,18.29
  Bottom 0.406: U1.11 52.69,4.3 C21.1 | U1.10 52.94,4.85 F3.2
  Bottom 0.61: F3.2 C21.1
VTL_+3.3V1  (via drill 0.2)
  GND13 0.157: v8.38,18.54 10.41,15.75 v13.74,15.72
  Bottom 0.157: R48.2 10.01,16.36 9.91,16.26 9.91,15.49 10.46,15.49 U8.P$15 U8.P$14 | R48.2 10.01,17.63 v8.38,18.54 | v13.74,15.72 13.63,15.7 13.39,15.85 U8.P$5 | R48.2 C26.1
VTL_LISA_VCC1
  Bottom 0.157: U8.P$13 9.9,14.64 R49.2 C25.1
WAKE_M1  (via drill 0.2)
  Top 0.157: v35.81,17.04 35.2,17.02 R1.1 | D7.ANODE 2.79,3.05 v3.81,2.79
  GND2 0.157: v35.81,17.04 36.69,15.84 38.1,15.24 41.4,11.25 41.45,9.12 40.69,8.36 39.12,6.6 36.58,3.81 33.02,3.81 32.05,4.62 31.04,4.62 29.72,3.56 22.1,3.56 21.48,2.51 v21.26,0.69
  PWR 0.157: v3.81,2.79 4.32,2.29 6.6,2.29 7.11,3.3 20.83,3.3 21.34,2.54 21.49,2.23 v21.26,0.69
  Bottom 0.157: U5.50 36.57,16.22 36.04,15.88 35.59,16.26 35.56,16.61 v35.81,17.04 | U6.28 19.96,5.26 20.45,4.7 20.68,4.47 20.9,4.39 20.9,2.72 21.49,2.23 21.49,1.85 21.26,1.63 v21.26,0.69
WAKE_M2  (via drill 0.2)
  Top 0.157: v37.64,17.02 37.72,16.79 R24.1 R11.2 36.32,16.26 35.2,16.33 34.57,16.36 34.34,16.33 34.16,16.39 SW4.A SW4.A2
  GND15 0.157: v21.82,4.45 22.35,3.81 24.38,3.81 28.37,8.26 35.26,8.26 35.99,9.04 35.99,13.54 38.1,14.73 38.1,16.51 v37.64,17.02
  Bottom 0.157: U5.54 38.1,14.99 38.61,15.49 38.61,15.9 v37.64,17.02 | U6.27 20.36,5.29 20.8,4.85 v21.82,4.45